# Altium project Stag12.PrjPcb (part 1 of 3)
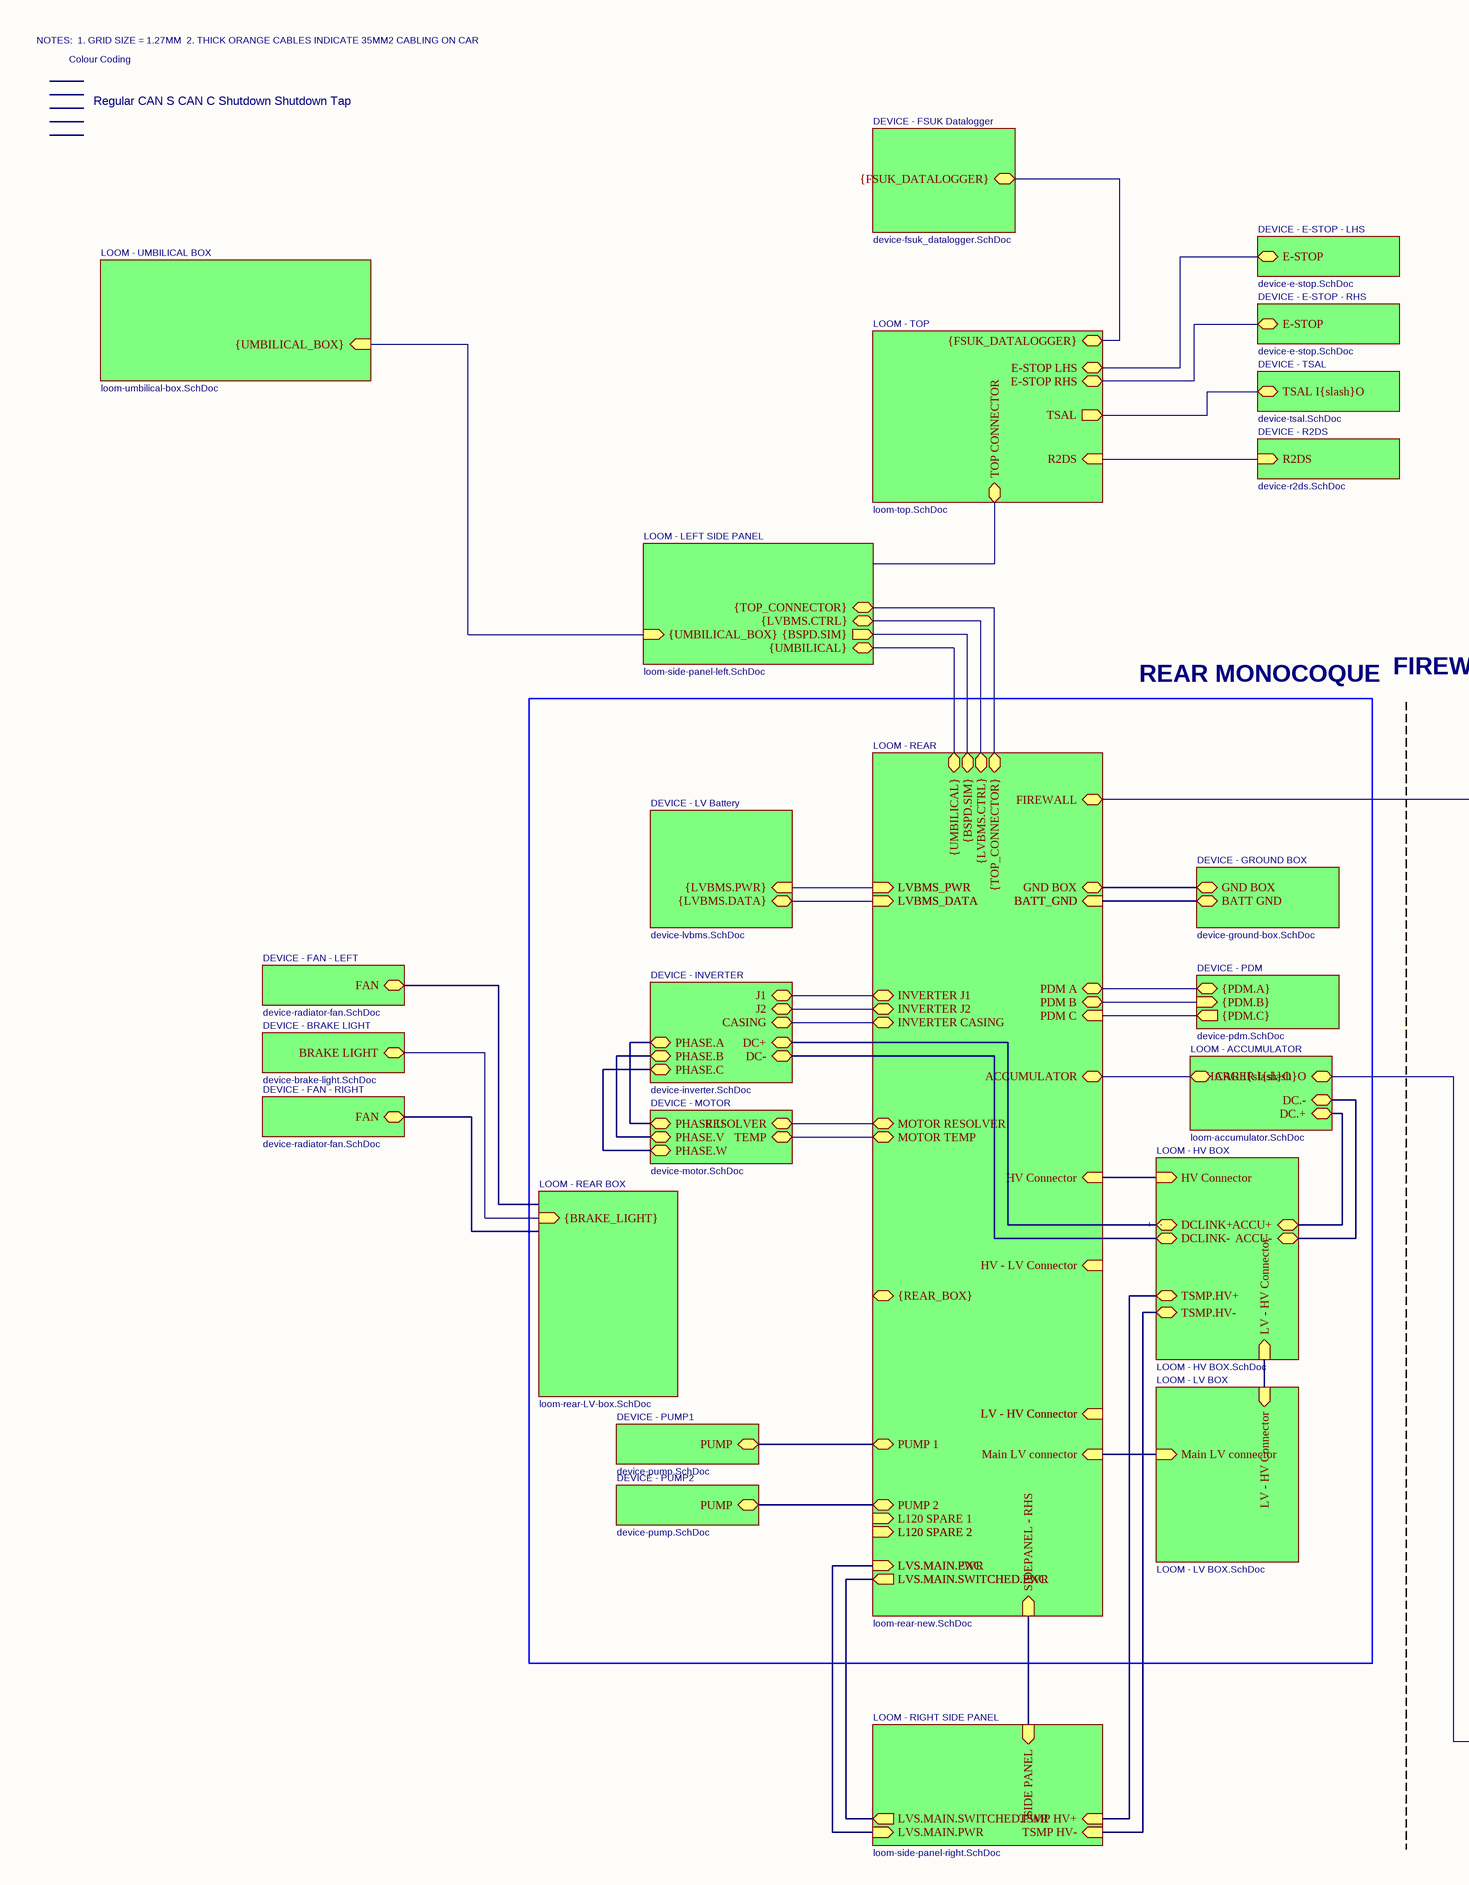
[diagram p0: Stag12.SchDoc, left]
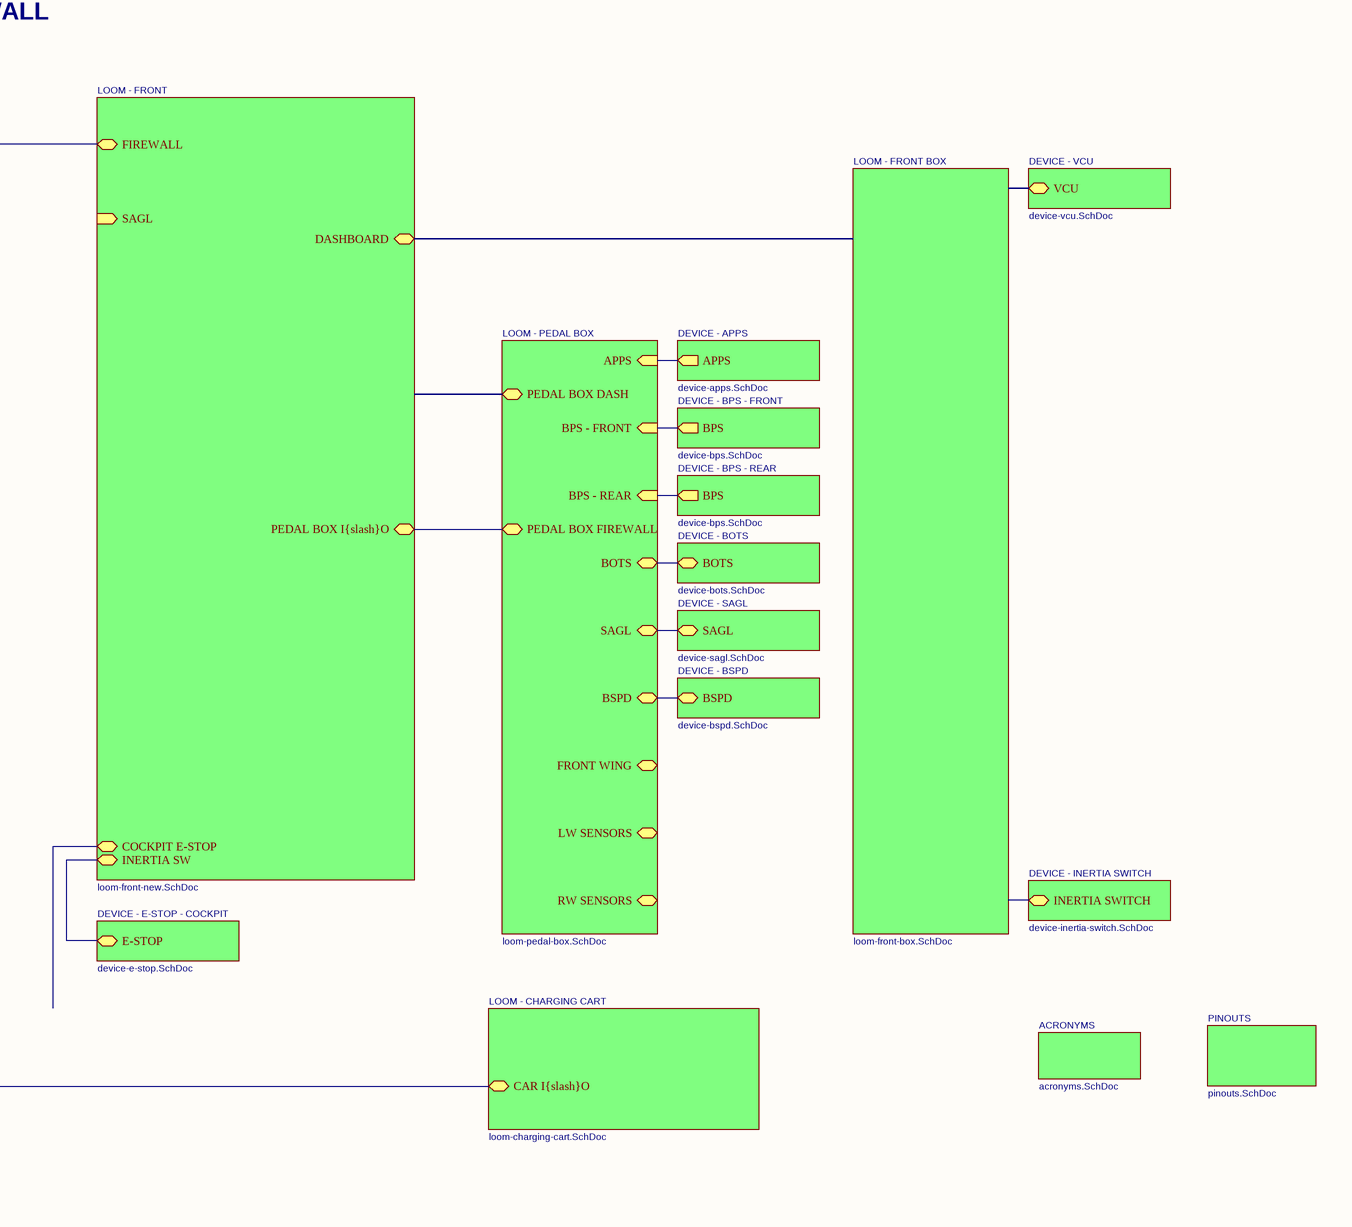
[diagram p1: Stag12.SchDoc, right]
39 sheets, 289 parts. Net scope: hierarchical (ports join the sheet entries above them; power ports are global).
Sheets:
  Stag12.SchDoc
    DEVICE - BOTS = device-bots.SchDoc
    LOOM - REAR BOX = loom-rear-LV-box.SchDoc
    DEVICE - PDM = device-pdm.SchDoc
    ACRONYMS = acronyms.SchDoc
    DEVICE - PUMP2 = device-pump.SchDoc
    LOOM - FRONT = loom-front-new.SchDoc
    DEVICE - E-STOP - COCKPIT = device-e-stop.SchDoc
    DEVICE - INVERTER = device-inverter.SchDoc
    DEVICE - TSAL = device-tsal.SchDoc
    DEVICE - PUMP1 = device-pump.SchDoc
    DEVICE - FAN - RIGHT = device-radiator-fan.SchDoc
    DEVICE - APPS = device-apps.SchDoc
    DEVICE - INERTIA SWITCH = device-inertia-switch.SchDoc
    LOOM - LEFT SIDE PANEL = loom-side-panel-left.SchDoc
    DEVICE - FAN - LEFT = device-radiator-fan.SchDoc
    LOOM - TOP = loom-top.SchDoc
    LOOM - LV BOX = LOOM - LV BOX.SchDoc
    LOOM - HV BOX = LOOM - HV BOX.SchDoc
    DEVICE - E-STOP - LHS = device-e-stop.SchDoc
    DEVICE - BPS - FRONT = device-bps.SchDoc
    LOOM - FRONT BOX = loom-front-box.SchDoc
    DEVICE - E-STOP - RHS = device-e-stop.SchDoc
    LOOM - RIGHT SIDE PANEL = loom-side-panel-right.SchDoc
    DEVICE - BSPD = device-bspd.SchDoc
    DEVICE - GROUND BOX = device-ground-box.SchDoc
    DEVICE - MOTOR = device-motor.SchDoc
    LOOM - REAR = loom-rear-new.SchDoc
    LOOM - CHARGING CART = loom-charging-cart.SchDoc
    DEVICE - SAGL = device-sagl.SchDoc
    DEVICE - VCU = device-vcu.SchDoc
    DEVICE - R2DS = device-r2ds.SchDoc
    LOOM - ACCUMULATOR = loom-accumulator.SchDoc
    PINOUTS = pinouts.SchDoc
    LOOM - UMBILICAL BOX = loom-umbilical-box.SchDoc
    DEVICE - BPS - REAR = device-bps.SchDoc
    DEVICE - LV Battery = device-lvbms.SchDoc
    LOOM - PEDAL BOX = loom-pedal-box.SchDoc
    DEVICE - FSUK Datalogger = device-fsuk_datalogger.SchDoc
    DEVICE - BRAKE LIGHT = device-brake-light.SchDoc
  loom-dash-box.SchDoc
  loom-dummy-accumulator.SchDoc
  loom-roll-hoop.SchDoc
  loom-side-panel.SchDoc

## Sheet Stag12.SchDoc
size 594 x 420 mm

### Sub-sheets
ACRONYMS = acronyms.SchDoc: no entries
DEVICE - APPS = device-apps.SchDoc: APPS (out)
DEVICE - BOTS = device-bots.SchDoc: BOTS (bidir)
DEVICE - BPS - FRONT = device-bps.SchDoc: BPS (out)
DEVICE - BPS - REAR = device-bps.SchDoc: BPS (out)
DEVICE - BRAKE LIGHT = device-brake-light.SchDoc: BRAKE LIGHT (bidir)
DEVICE - BSPD = device-bspd.SchDoc: BSPD (bidir)
DEVICE - E-STOP - COCKPIT = device-e-stop.SchDoc: E-STOP (bidir)
DEVICE - E-STOP - LHS = device-e-stop.SchDoc: E-STOP (bidir)
DEVICE - E-STOP - RHS = device-e-stop.SchDoc: E-STOP (bidir)
DEVICE - FAN - LEFT = device-radiator-fan.SchDoc: FAN (bidir)
DEVICE - FAN - RIGHT = device-radiator-fan.SchDoc: FAN (bidir)
DEVICE - FSUK Datalogger = device-fsuk_datalogger.SchDoc: {FSUK_DATALOGGER} (bidir)
DEVICE - GROUND BOX = device-ground-box.SchDoc: GND BOX (bidir), BATT GND (bidir)
DEVICE - INERTIA SWITCH = device-inertia-switch.SchDoc: INERTIA SWITCH (bidir)
DEVICE - INVERTER = device-inverter.SchDoc: PHASE.A (bidir), PHASE.B (bidir), PHASE.C (bidir), J1 (bidir), J2 (bidir), CASING (bidir), DC+ (bidir), DC- (bidir)
DEVICE - LV Battery = device-lvbms.SchDoc: {LVBMS.PWR} (in), {LVBMS.DATA} (bidir)
DEVICE - MOTOR = device-motor.SchDoc: PHASE.V (bidir), PHASE.U (bidir), PHASE.W (bidir), RESOLVER (bidir), TEMP (bidir)
DEVICE - PDM = device-pdm.SchDoc: {PDM.A} (bidir), {PDM.B} (in), {PDM.C} (out)
DEVICE - PUMP1 = device-pump.SchDoc: PUMP (bidir)
DEVICE - PUMP2 = device-pump.SchDoc: PUMP (bidir)
DEVICE - R2DS = device-r2ds.SchDoc: R2DS (in)
DEVICE - SAGL = device-sagl.SchDoc: SAGL (bidir)
DEVICE - TSAL = device-tsal.SchDoc: TSAL I{slash}O (bidir)
DEVICE - VCU = device-vcu.SchDoc: VCU (bidir)
LOOM - ACCUMULATOR = loom-accumulator.SchDoc: CHARGER I{slash}O (bidir), CAR I{slash}O (bidir), DC.- (bidir), DC.+ (bidir)
LOOM - CHARGING CART = loom-charging-cart.SchDoc: CAR I{slash}O (bidir)
LOOM - FRONT = loom-front-new.SchDoc: DASHBOARD (bidir), FIREWALL (bidir), PEDAL BOX I{slash}O (bidir), SAGL (in), COCKPIT E-STOP (bidir), INERTIA SW (bidir)
LOOM - FRONT BOX = loom-front-box.SchDoc: no entries
LOOM - HV BOX = LOOM - HV BOX.SchDoc: TSMP.HV- (bidir), TSMP.HV+ (bidir), LV - HV Connector (in), HV Connector (in), ACCU+ (bidir), ACCU- (bidir), DCLINK+ (bidir), DCLINK- (bidir)
LOOM - LEFT SIDE PANEL = loom-side-panel-left.SchDoc: {UMBILICAL} (bidir), {LVBMS.CTRL} (bidir), {UMBILICAL_BOX} (in), {BSPD.SIM} (out), {TOP_CONNECTOR} (bidir)
LOOM - LV BOX = LOOM - LV BOX.SchDoc: Main LV connector (in), LV - HV Connector (in)
LOOM - PEDAL BOX = loom-pedal-box.SchDoc: APPS (in), BPS - FRONT (in), BPS - REAR (in), BOTS (bidir), SAGL (bidir), BSPD (bidir), FRONT WING (bidir), LW SENSORS (bidir), PEDAL BOX DASH (bidir), PEDAL BOX FIREWALL (bidir), RW SENSORS (bidir)
LOOM - REAR = loom-rear-new.SchDoc: {UMBILICAL} (bidir), GND BOX (bidir), SIDEPANEL - RHS (in), PDM A (bidir), PDM B (bidir), Main LV connector (in), HV Connector (in), ACCUMULATOR (bidir), FIREWALL (bidir), INVERTER J2 (bidir), INVERTER J1 (bidir), MOTOR RESOLVER (bidir), INVERTER CASING (bidir), MOTOR TEMP (bidir), PUMP 1 (bidir), PUMP 2 (bidir), HV - LV Connector (in), L120 SPARE 1 (in), L120 SPARE 2 (in), LV - HV Connector (in), LVS.MAIN.PWR (in), LVS.MAIN.SWITCHED.PWR (out), BATT_GND (in), LVBMS_DATA (in), LVBMS_PWR (in), L120 SPARE 2 (in), LV - HV Connector (in), LVS.MAIN.EXC (in), LVS.MAIN.SWITCHED.EXC (out), BATT_GND (in), LVBMS_DATA (in), LVBMS_PWR (in), {BSPD.SIM} (bidir), {LVBMS.CTRL} (bidir), PDM C (in), {REAR_BOX} (bidir), {TOP_CONNECTOR} (bidir)
LOOM - REAR BOX = loom-rear-LV-box.SchDoc: {BRAKE_LIGHT} (in)
LOOM - RIGHT SIDE PANEL = loom-side-panel-right.SchDoc: LVS.MAIN.PWR (in), TSMP HV- (in), TSMP HV+ (in), SIDE PANEL (in), LVS.MAIN.SWITCHED.PWR (out)
LOOM - TOP = loom-top.SchDoc: TOP CONNECTOR (bidir), TSAL (out), {FSUK_DATALOGGER} (bidir), E-STOP LHS (bidir), E-STOP RHS (bidir), R2DS (in)
LOOM - UMBILICAL BOX = loom-umbilical-box.SchDoc: {UMBILICAL_BOX} (in)
PINOUTS = pinouts.SchDoc: no entries

### Nets
BATT.POS: sheet DEVICE - PDM/{PDM.B}, sheet LOOM - REAR/PDM B
CASING: sheet DEVICE - INVERTER/CASING, sheet LOOM - REAR/INVERTER CASING
DC+: sheet DEVICE - INVERTER/DC+, sheet LOOM - HV BOX/DCLINK+
DC-: sheet DEVICE - INVERTER/DC-, sheet LOOM - HV BOX/DCLINK-
GLV.GND: sheet DEVICE - GROUND BOX/BATT GND, sheet LOOM - REAR/BATT_GND, sheet LOOM - REAR/BATT_GND
GLV.LVMS+: sheet LOOM - RIGHT SIDE PANEL/LVS.MAIN.PWR, sheet LOOM - REAR/LVS.MAIN.PWR, sheet LOOM - REAR/LVS.MAIN.EXC
GND BOX: sheet DEVICE - GROUND BOX/GND BOX, sheet LOOM - REAR/GND BOX
HV Connector: sheet LOOM - HV BOX/HV Connector, sheet LOOM - REAR/HV Connector
L120 SPARE 2: sheet LOOM - REAR/L120 SPARE 2, sheet LOOM - REAR/L120 SPARE 2
LV - HV Connector: sheet LOOM - LV BOX/LV - HV Connector, sheet LOOM - HV BOX/LV - HV Connector
LVS.MAIN.SWITCHED.EXC: sheet LOOM - RIGHT SIDE PANEL/LVS.MAIN.SWITCHED.PWR, sheet LOOM - REAR/LVS.MAIN.SWITCHED.PWR, sheet LOOM - REAR/LVS.MAIN.SWITCHED.EXC
Main LV connector: sheet LOOM - LV BOX/Main LV connector, sheet LOOM - REAR/Main LV connector
PHASE.A: sheet DEVICE - INVERTER/PHASE.A, sheet DEVICE - MOTOR/PHASE.U
PHASE.B: sheet DEVICE - INVERTER/PHASE.B, sheet DEVICE - MOTOR/PHASE.V
PHASE.C: sheet DEVICE - INVERTER/PHASE.C, sheet DEVICE - MOTOR/PHASE.W
PUMP_DEVICE - PUMP1: sheet DEVICE - PUMP1/PUMP, sheet LOOM - REAR/PUMP 1
PUMP_DEVICE - PUMP2: sheet DEVICE - PUMP2/PUMP, sheet LOOM - REAR/PUMP 2
SIDE PANEL: sheet LOOM - RIGHT SIDE PANEL/SIDE PANEL, sheet LOOM - REAR/SIDEPANEL - RHS
TSMP HV+: sheet LOOM - HV BOX/TSMP.HV+, sheet LOOM - RIGHT SIDE PANEL/TSMP HV+
TSMP HV-: sheet LOOM - HV BOX/TSMP.HV-, sheet LOOM - RIGHT SIDE PANEL/TSMP HV-
(unnamed): sheet LOOM - HV BOX/ACCU+, sheet LOOM - ACCUMULATOR/DC.+
(unnamed): sheet LOOM - HV BOX/ACCU-, sheet LOOM - ACCUMULATOR/DC.-
(unnamed): sheet LOOM - REAR/LV - HV Connector, sheet LOOM - REAR/LV - HV Connector

### Buses and harness runs
bus sheet DEVICE - APPS/APPS = sheet LOOM - PEDAL BOX/APPS
bus sheet DEVICE - BOTS/BOTS = sheet LOOM - PEDAL BOX/BOTS
bus sheet DEVICE - BPS - FRONT/BPS = sheet LOOM - PEDAL BOX/BPS - FRONT
bus sheet DEVICE - BPS - REAR/BPS = sheet LOOM - PEDAL BOX/BPS - REAR
bus sheet DEVICE - BRAKE LIGHT/BRAKE LIGHT = sheet LOOM - REAR BOX/{BRAKE_LIGHT}
bus sheet DEVICE - BSPD/BSPD = sheet LOOM - PEDAL BOX/BSPD
bus sheet DEVICE - E-STOP - COCKPIT/E-STOP = sheet LOOM - FRONT/INERTIA SW
bus sheet DEVICE - E-STOP - LHS/E-STOP = sheet LOOM - TOP/E-STOP LHS
bus sheet DEVICE - E-STOP - RHS/E-STOP = sheet LOOM - TOP/E-STOP RHS
bus sheet DEVICE - FSUK Datalogger/{FSUK_DATALOGGER} = sheet LOOM - TOP/{FSUK_DATALOGGER}
bus sheet DEVICE - INVERTER/CASING = sheet LOOM - REAR/INVERTER CASING
bus sheet DEVICE - INVERTER/J1 = sheet LOOM - REAR/INVERTER J1
bus sheet DEVICE - INVERTER/J2 = sheet LOOM - REAR/INVERTER J2
bus sheet DEVICE - LV Battery/{LVBMS.DATA} = sheet LOOM - REAR/LVBMS_DATA
bus sheet DEVICE - LV Battery/{LVBMS.PWR} = sheet LOOM - REAR/LVBMS_PWR
bus sheet DEVICE - MOTOR/RESOLVER = sheet LOOM - REAR/MOTOR RESOLVER
bus sheet DEVICE - MOTOR/TEMP = sheet LOOM - REAR/MOTOR TEMP
bus sheet DEVICE - PDM/{PDM.A} = sheet LOOM - REAR/PDM A
bus sheet DEVICE - PDM/{PDM.B} = sheet LOOM - REAR/PDM B
bus sheet DEVICE - PDM/{PDM.C} = sheet LOOM - REAR/PDM C
bus sheet DEVICE - R2DS/R2DS = sheet LOOM - TOP/R2DS
bus sheet DEVICE - SAGL/SAGL = sheet LOOM - PEDAL BOX/SAGL
bus sheet DEVICE - TSAL/TSAL I{slash}O = sheet LOOM - TOP/TSAL
bus sheet LOOM - ACCUMULATOR/CAR I{slash}O = sheet LOOM - REAR/ACCUMULATOR
bus sheet LOOM - ACCUMULATOR/CHARGER I{slash}O = sheet LOOM - CHARGING CART/CAR I{slash}O
bus sheet LOOM - FRONT/FIREWALL = sheet LOOM - REAR/FIREWALL
bus sheet LOOM - FRONT/PEDAL BOX I{slash}O = sheet LOOM - PEDAL BOX/PEDAL BOX FIREWALL
bus sheet LOOM - LEFT SIDE PANEL/{BSPD.SIM} = sheet LOOM - REAR/{BSPD.SIM}
bus sheet LOOM - LEFT SIDE PANEL/{LVBMS.CTRL} = sheet LOOM - REAR/{LVBMS.CTRL}
bus sheet LOOM - LEFT SIDE PANEL/{TOP_CONNECTOR} = sheet LOOM - REAR/{TOP_CONNECTOR}
bus sheet LOOM - LEFT SIDE PANEL/{UMBILICAL_BOX} = sheet LOOM - UMBILICAL BOX/{UMBILICAL_BOX}
bus sheet LOOM - LEFT SIDE PANEL/{UMBILICAL} = sheet LOOM - REAR/{UMBILICAL}

### Notes on the sheet
- NOTES:
  1. GRID SIZE = 1.27MM
  2. THICK ORANGE CABLES INDICATE 35MM2 CABLING ON CAR
- Colour Coding
- Regular
  CAN S
  CAN C
  Shutdown
  Shutdown Tap
- REAR MONOCOQUE
- FIREWALL
- +
  -
- 1
- 2
- 3
- 4
- 5
- 6
- 7
- 8
- 9
- 10
- 11
- A
- B
- C
- D
- E
- F
- G
- H
- Title: STAG 12 - TOP LEVEL
- File: Stag12.kicad_sch
- Sheet: /
- KiCad E.D.A.  kicad (5.1.4)-1
- Size: A2
- Date:
- Rev:
- Id: 1/1

## Sheet device-bots.SchDoc
size 297 x 209 mm
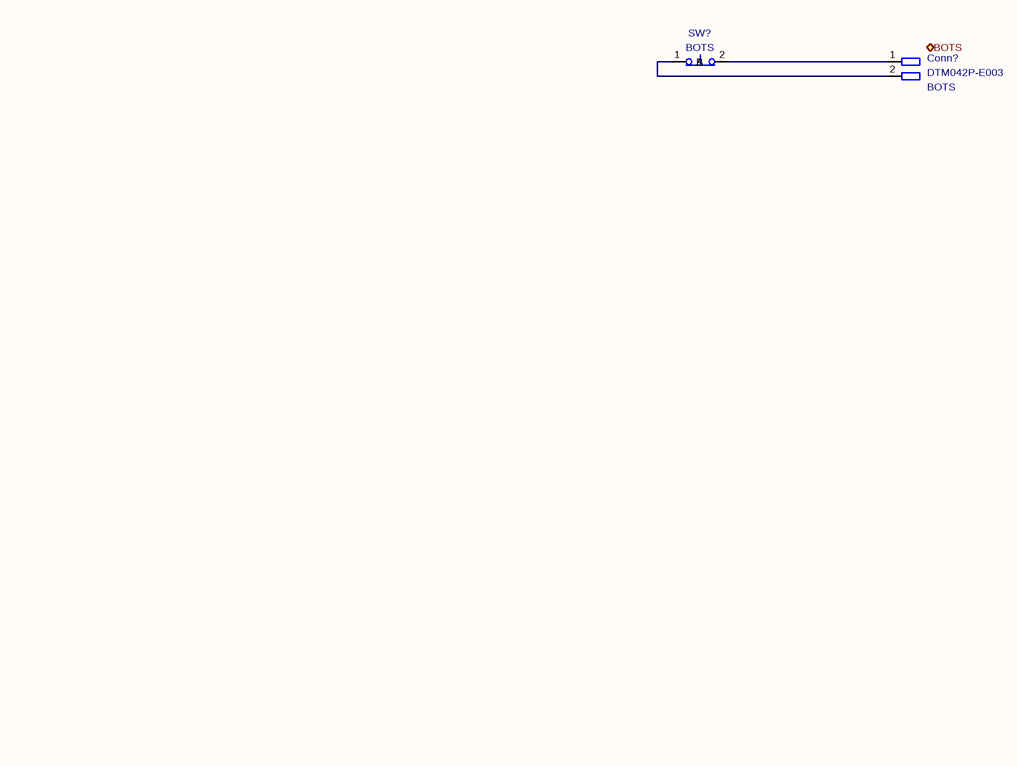
[diagram p2: device-bots.SchDoc]

### Parts
(Parts that share a designator on the sheet are numbered #1, #2 ... from top to bottom, then left to right.)
Conn?#1  P/N: DTM042P-E003  Conn Name: BOTS  (hidden comment: Deutsch_DTM_2P_Pin)
SW?  BOTS

### Ports
BOTS (bidir)

### Nets
NetConn?#1_1: Conn?#1.1 SW?.2(B)
NetConn?#1_2: Conn?#1.2 SW?.1(A)

### Notes on the sheet
- 1
- 2
- 3
- 4
- 5
- 6
- A
- B
- C
- D
- Title: DEVICE - BOTS
- File: device-bots.kicad_sch
- Sheet: /
- KiCad E.D.A.  kicad (5.1.4)-1
- Size: A4
- Date:
- Rev:
- Id: 1/1

### Library data of the parts
SW? = SW_Push_Open: Value: BOTS
Conn?#1 = Deutsch_DTM_2P_Pin: Value: Deutsch_DTM_2P_Pin

## Sheet loom-rear-LV-box.SchDoc
size 420 x 297 mm
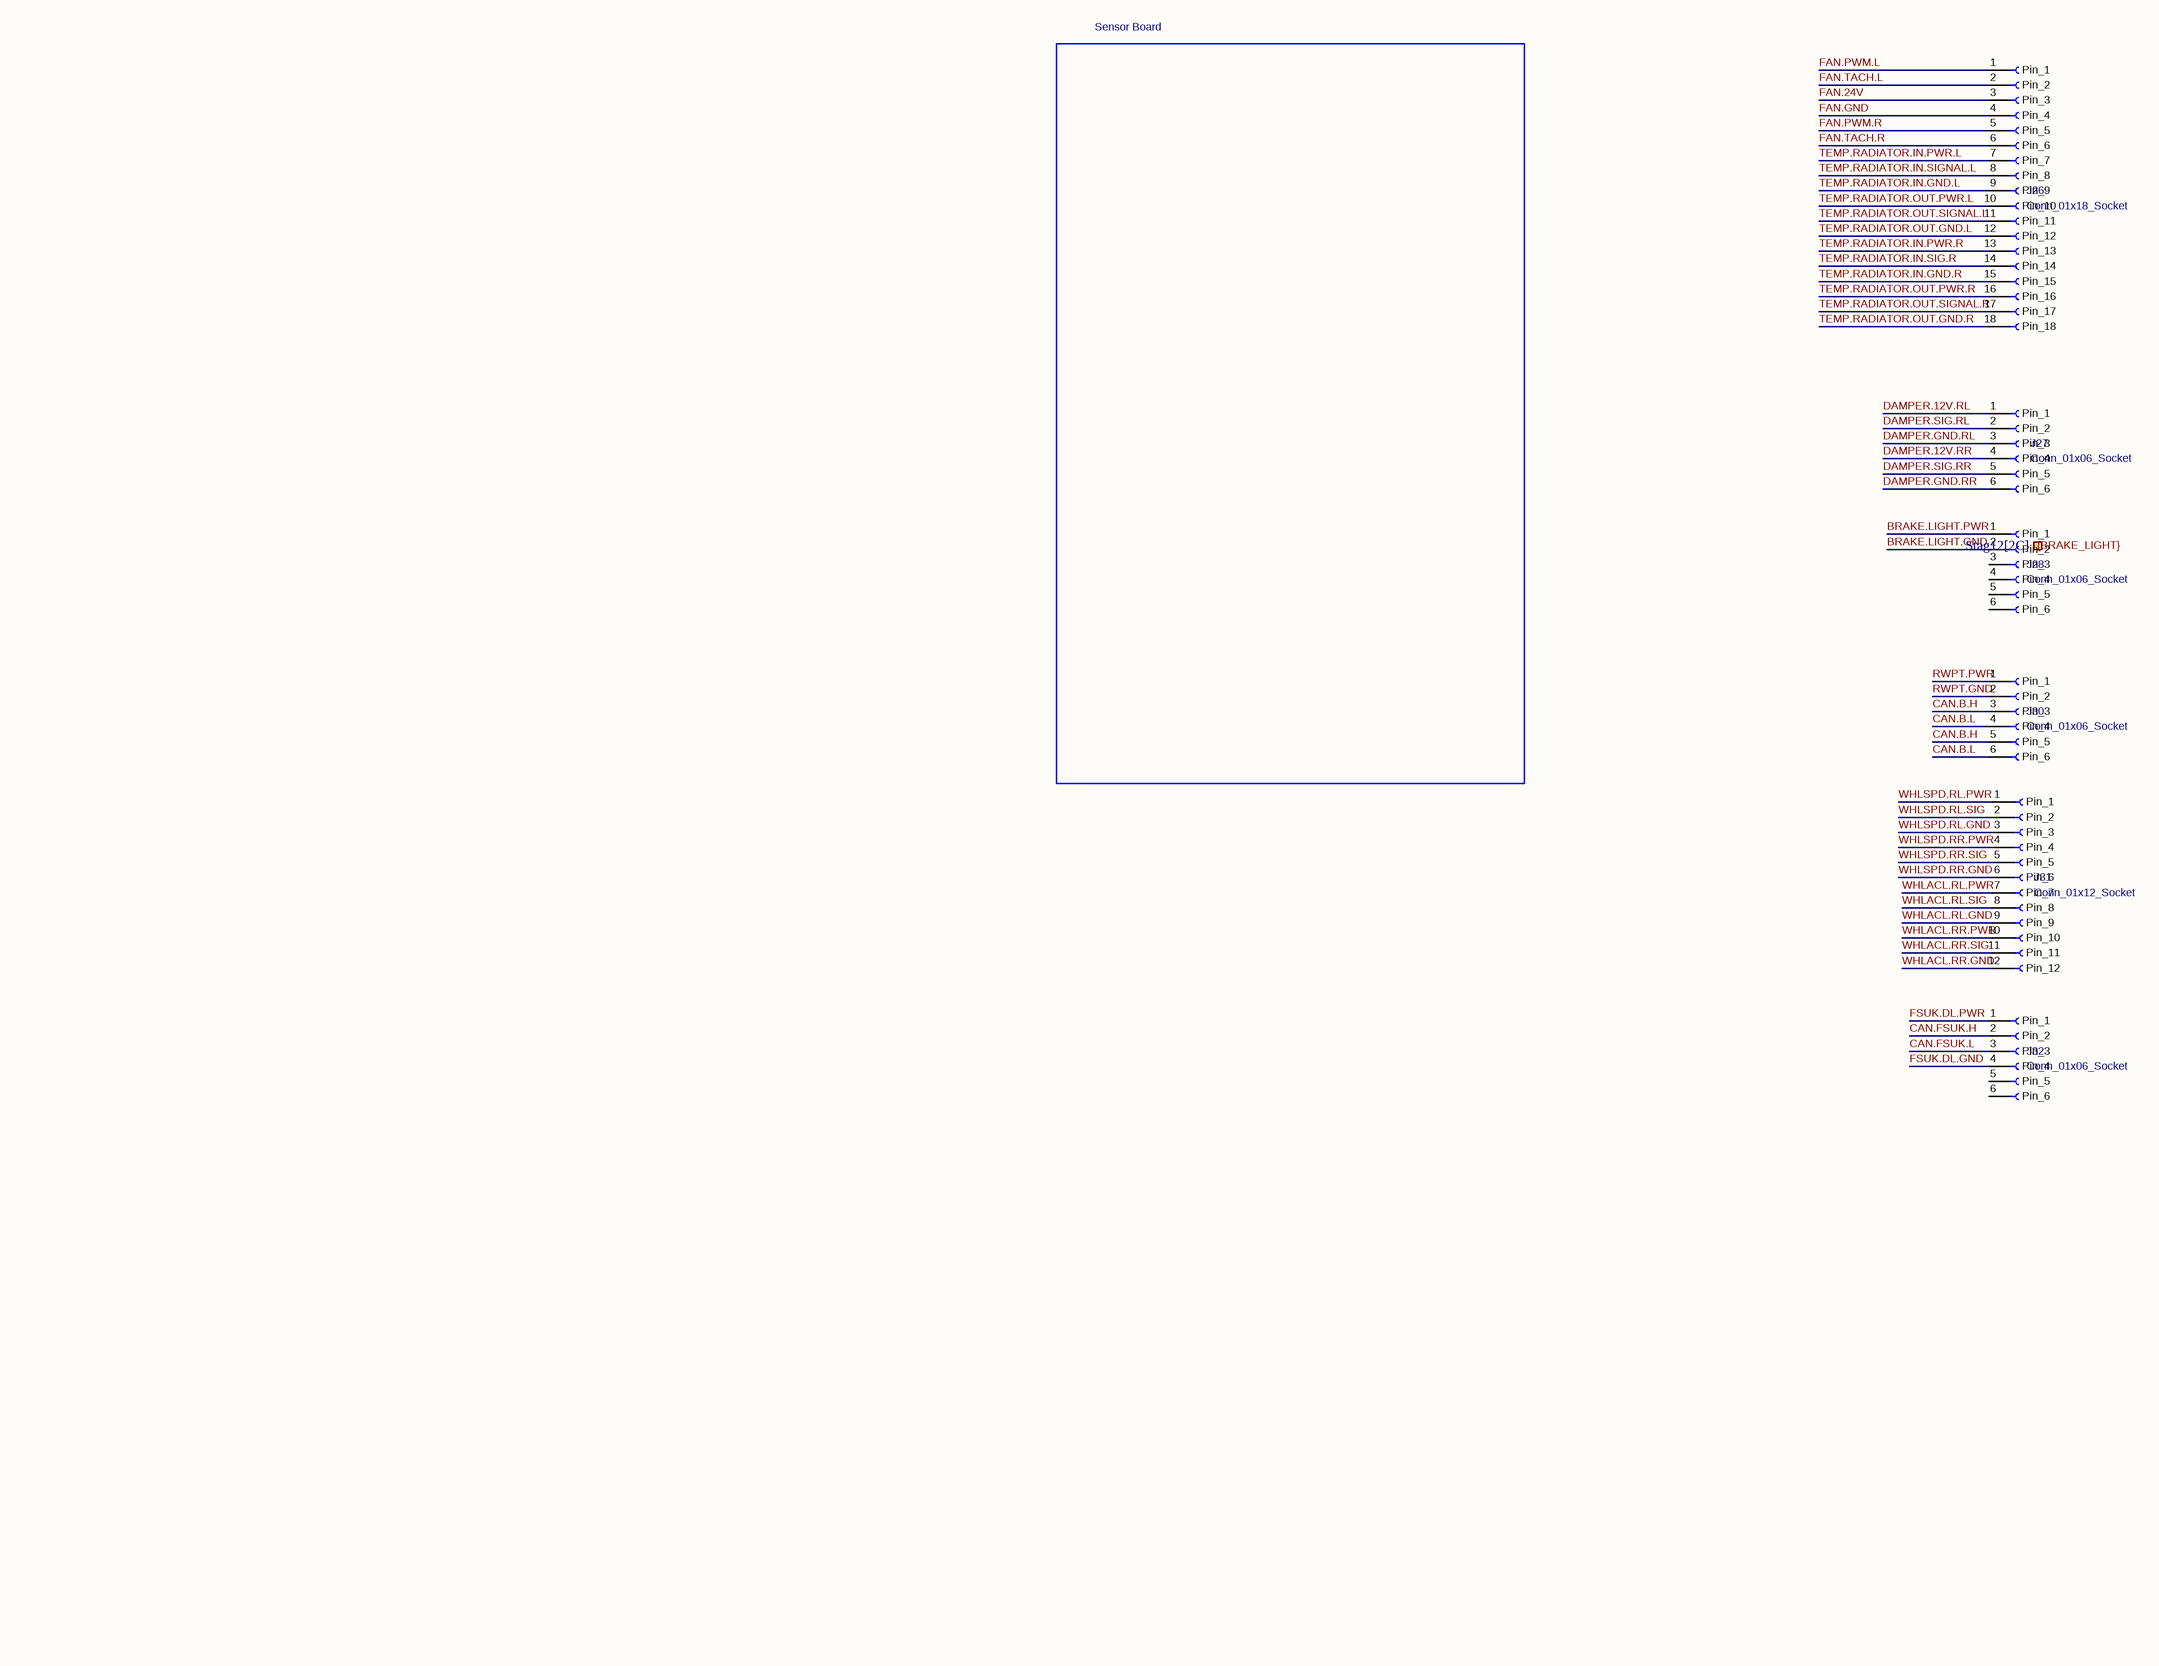
[diagram p3: loom-rear-LV-box.SchDoc]

### Parts
J26  Conn_01x18_Socket
J27  Conn_01x06_Socket
J28  Conn_01x06_Socket
J30  Conn_01x06_Socket
J31  Conn_01x12_Socket
J32  Conn_01x06_Socket

### Ports
{BRAKE_LIGHT} (in, see Stag12[2C])

### Nets
BRAKE.LIGHT.GND: J28.2(Pin_2)
BRAKE.LIGHT.PWR: J28.1(Pin_1)
CAN.B.H: J30.3(Pin_3) J30.5(Pin_5)
CAN.B.L: J30.4(Pin_4) J30.6(Pin_6)
CAN.FSUK.H: J32.2(Pin_2)
CAN.FSUK.L: J32.3(Pin_3)
DAMPER.12V.RL: J27.1(Pin_1)
DAMPER.12V.RR: J27.4(Pin_4)
DAMPER.GND.RL: J27.3(Pin_3)
DAMPER.GND.RR: J27.6(Pin_6)
DAMPER.SIG.RL: J27.2(Pin_2)
DAMPER.SIG.RR: J27.5(Pin_5)
FAN.24V: J26.3(Pin_3)
FAN.GND: J26.4(Pin_4)
FAN.PWM.L: J26.1(Pin_1)
FAN.PWM.R: J26.5(Pin_5)
FAN.TACH.L: J26.2(Pin_2)
FAN.TACH.R: J26.6(Pin_6)
FSUK.DL.GND: J32.4(Pin_4)
FSUK.DL.PWR: J32.1(Pin_1)
RWPT.GND: J30.2(Pin_2)
RWPT.PWR: J30.1(Pin_1)
TEMP.RADIATOR.IN.GND.L: J26.9(Pin_9)
TEMP.RADIATOR.IN.GND.R: J26.15(Pin_15)
TEMP.RADIATOR.IN.PWR.L: J26.7(Pin_7)
TEMP.RADIATOR.IN.PWR.R: J26.13(Pin_13)
TEMP.RADIATOR.IN.SIG.R: J26.14(Pin_14)
TEMP.RADIATOR.IN.SIGNAL.L: J26.8(Pin_8)
TEMP.RADIATOR.OUT.GND.L: J26.12(Pin_12)
TEMP.RADIATOR.OUT.GND.R: J26.18(Pin_18)
TEMP.RADIATOR.OUT.PWR.L: J26.10(Pin_10)
TEMP.RADIATOR.OUT.PWR.R: J26.16(Pin_16)
TEMP.RADIATOR.OUT.SIGNAL.L: J26.11(Pin_11)
TEMP.RADIATOR.OUT.SIGNAL.R: J26.17(Pin_17)
WHLACL.RL.GND: J31.9(Pin_9)
WHLACL.RL.PWR: J31.7(Pin_7)
WHLACL.RL.SIG: J31.8(Pin_8)
WHLACL.RR.GND: J31.12(Pin_12)
WHLACL.RR.PWR: J31.10(Pin_10)
WHLACL.RR.SIG: J31.11(Pin_11)
WHLSPD.RL.GND: J31.3(Pin_3)
WHLSPD.RL.PWR: J31.1(Pin_1)
WHLSPD.RL.SIG: J31.2(Pin_2)
WHLSPD.RR.GND: J31.6(Pin_6)
WHLSPD.RR.PWR: J31.4(Pin_4)
WHLSPD.RR.SIG: J31.5(Pin_5)

Not connected (* = marked no-connect by the designer): J28 3(Pin_3) 4(Pin_4) 5(Pin_5) 6(Pin_6); J32 5(Pin_5) 6(Pin_6)

### Notes on the sheet
- Sensor Board
- 1
- 2
- 3
- 4
- 5
- 6
- 7
- 8
- A
- B
- C
- D
- E
- Title:
- File: loom-rear-LV-box.kicad_sch
- Sheet: /
- F
- KiCad E.D.A.  kicad (5.1.4)-1
- Size: A3
- Date:
- Rev:
- Id: 1/1

### Library data of the parts
J26 = Conn_01x18_Socket: Value: Conn_01x18_Socket
J27 J28 J30 J32 = Conn_01x06_Socket: Value: Conn_01x06_Socket
J31 = Conn_01x12_Socket: Value: Conn_01x12_Socket

## Sheet device-pdm.SchDoc
size 297 x 209 mm
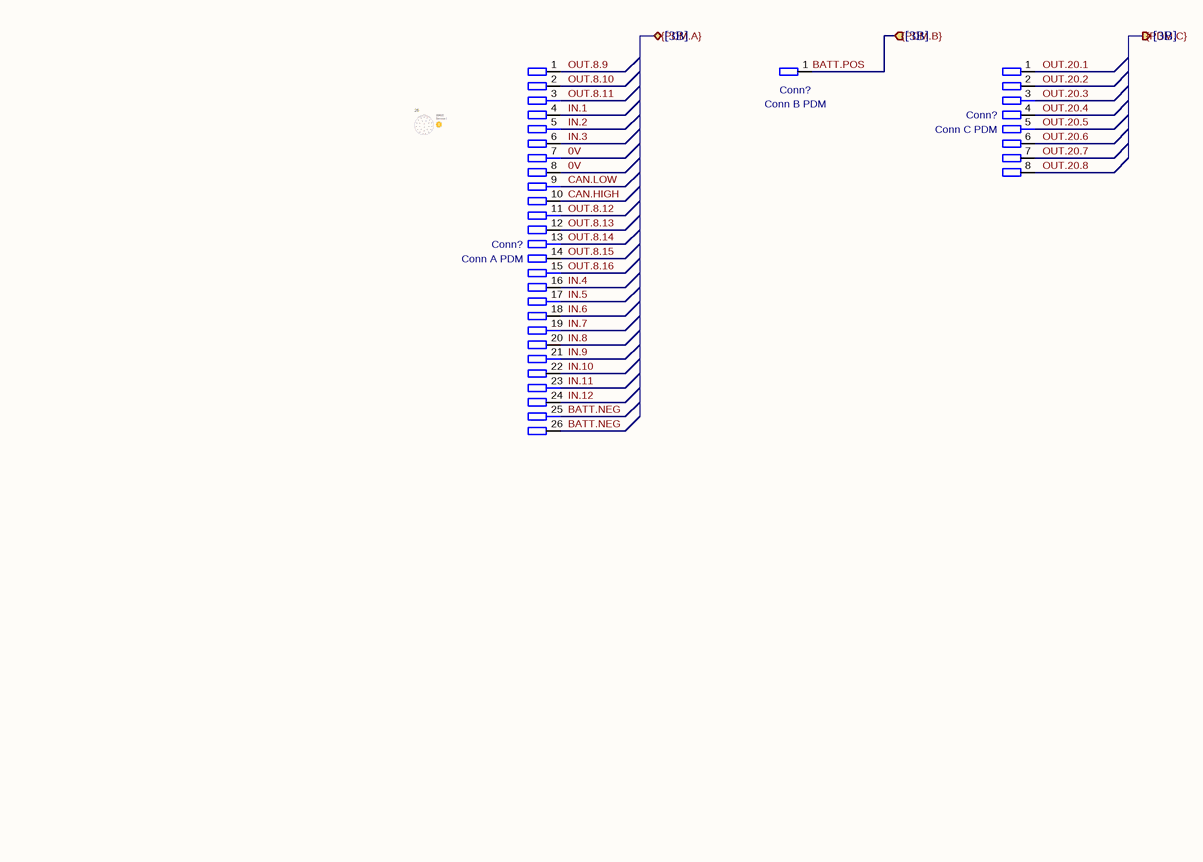
[diagram p4: device-pdm.SchDoc]

### Parts
(Parts that share a designator on the sheet are numbered #1, #2 ... from top to bottom, then left to right.)
Conn?#2  Conn A PDM
Conn?#3  Conn B PDM
Conn?#4  Conn C PDM

### Ports
{PDM.A} (bidir, see [3B]), {PDM.B} (in, see [3B]), {PDM.C} (out, see [3B])

### Nets
0V: Conn?#2.7 Conn?#2.8
BATT.NEG: Conn?#2.25 Conn?#2.26
BATT.POS: Conn?#3.1 ; port {PDM.B}
CAN.HIGH: Conn?#2.10
CAN.LOW: Conn?#2.9
IN.1: Conn?#2.4
IN.2: Conn?#2.5
IN.3: Conn?#2.6
IN.4: Conn?#2.16
IN.5: Conn?#2.17
IN.6: Conn?#2.18
IN.7: Conn?#2.19
IN.8: Conn?#2.20
IN.9: Conn?#2.21
IN.10: Conn?#2.22
IN.11: Conn?#2.23
IN.12: Conn?#2.24
OUT.8.9: Conn?#2.1
OUT.8.10: Conn?#2.2
OUT.8.11: Conn?#2.3
OUT.8.12: Conn?#2.11
OUT.8.13: Conn?#2.12
OUT.8.14: Conn?#2.13
OUT.8.15: Conn?#2.14
OUT.8.16: Conn?#2.15
OUT.20.1: Conn?#4.1
OUT.20.2: Conn?#4.2
OUT.20.3: Conn?#4.3
OUT.20.4: Conn?#4.4
OUT.20.5: Conn?#4.5
OUT.20.6: Conn?#4.6
OUT.20.7: Conn?#4.7
OUT.20.8: Conn?#4.8

### Notes on the sheet
- 1
- 2
- 3
- 4
- 5
- 6
- A
- B
- C
- D
- Title: DEVICE - PDM
- File: device-pdm.kicad_sch
- Sheet: /
- KiCad E.D.A.  kicad (5.1.4)-1
- Size: A4
- Date:
- Rev:
- Id: 1/1

### Library data of the parts
Conn?#2 = Conn A PDM: Value: Conn A PDM
Conn?#3 = Conn B PDM: Value: Conn B PDM
Conn?#4 = Conn C PDM: Value: Conn C PDM

## Sheet acronyms.SchDoc
size 420 x 297 mm
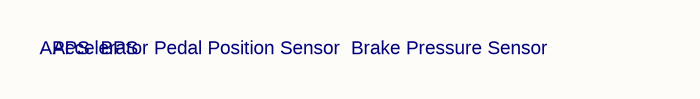
[diagram p5: acronyms.SchDoc]

### Notes on the sheet
- APPS
  BPS
- Accelerator Pedal Position Sensor
  Brake Pressure Sensor
- 1
- 2
- 3
- 4
- 5
- 6
- 7
- 8
- A
- B
- C
- D
- E
- Title: MISC - ACRONYMS
- File: acronyms.kicad_sch
- Sheet: /
- F
- KiCad E.D.A.  kicad (5.1.4)-1
- Size: A3
- Date:
- Rev:
- Id: 1/1

## Sheet device-pump.SchDoc
size 297 x 209 mm
Used 2 times, as channels DEVICE - PUMP2, DEVICE - PUMP1. Parts and nets are listed once, with the designators drawn on the sheet.
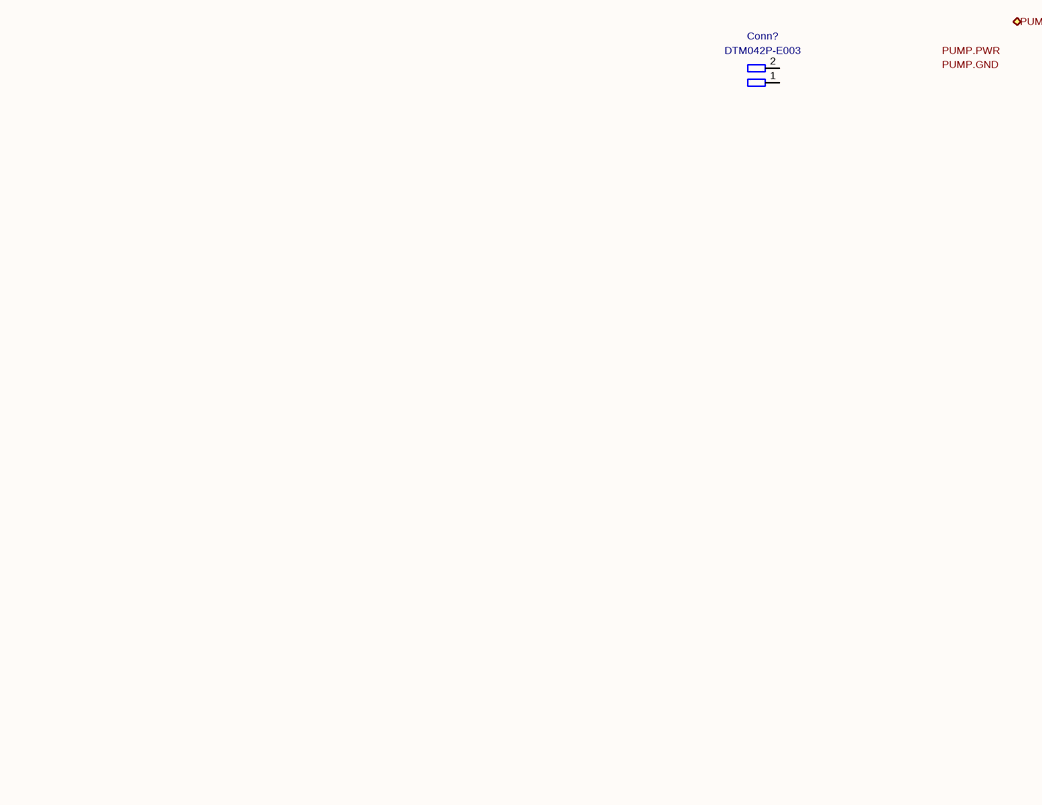
[diagram p6: device-pump.SchDoc]

### Parts
Conn?  P/N: DTM042P-E003  (hidden comment: Deutsch_DTM_2P_Pin)

### Ports
PUMP (bidir)

### Nets

Not connected (* = marked no-connect by the designer): Conn? 1 2

### Channels
DEVICE - PUMP2: designators end in _DEVICE_-_PUMP2; ports PUMP=PUMP_DEVICE - PUMP2
DEVICE - PUMP1: designators end in _DEVICE_-_PUMP1; ports PUMP=PUMP_DEVICE - PUMP1

### Notes on the sheet
- Labels drawn without touching a wire or pin: PUMP.GND, PUMP.PWR
- 1
- 2
- 3
- 4
- 5
- 6
- A
- B
- C
- D
- Title: DEVICE - PUMP
- File: device-pump.kicad_sch
- Sheet: /
- KiCad E.D.A.  kicad (5.1.4)-1
- Size: A4
- Date:
- Rev:
- Id: 1/1

### Library data of the parts
Conn? = Deutsch_DTM_2P_Pin: Value: Deutsch_DTM_2P_Pin

## Sheet loom-front-new.SchDoc
size 594 x 420 mm
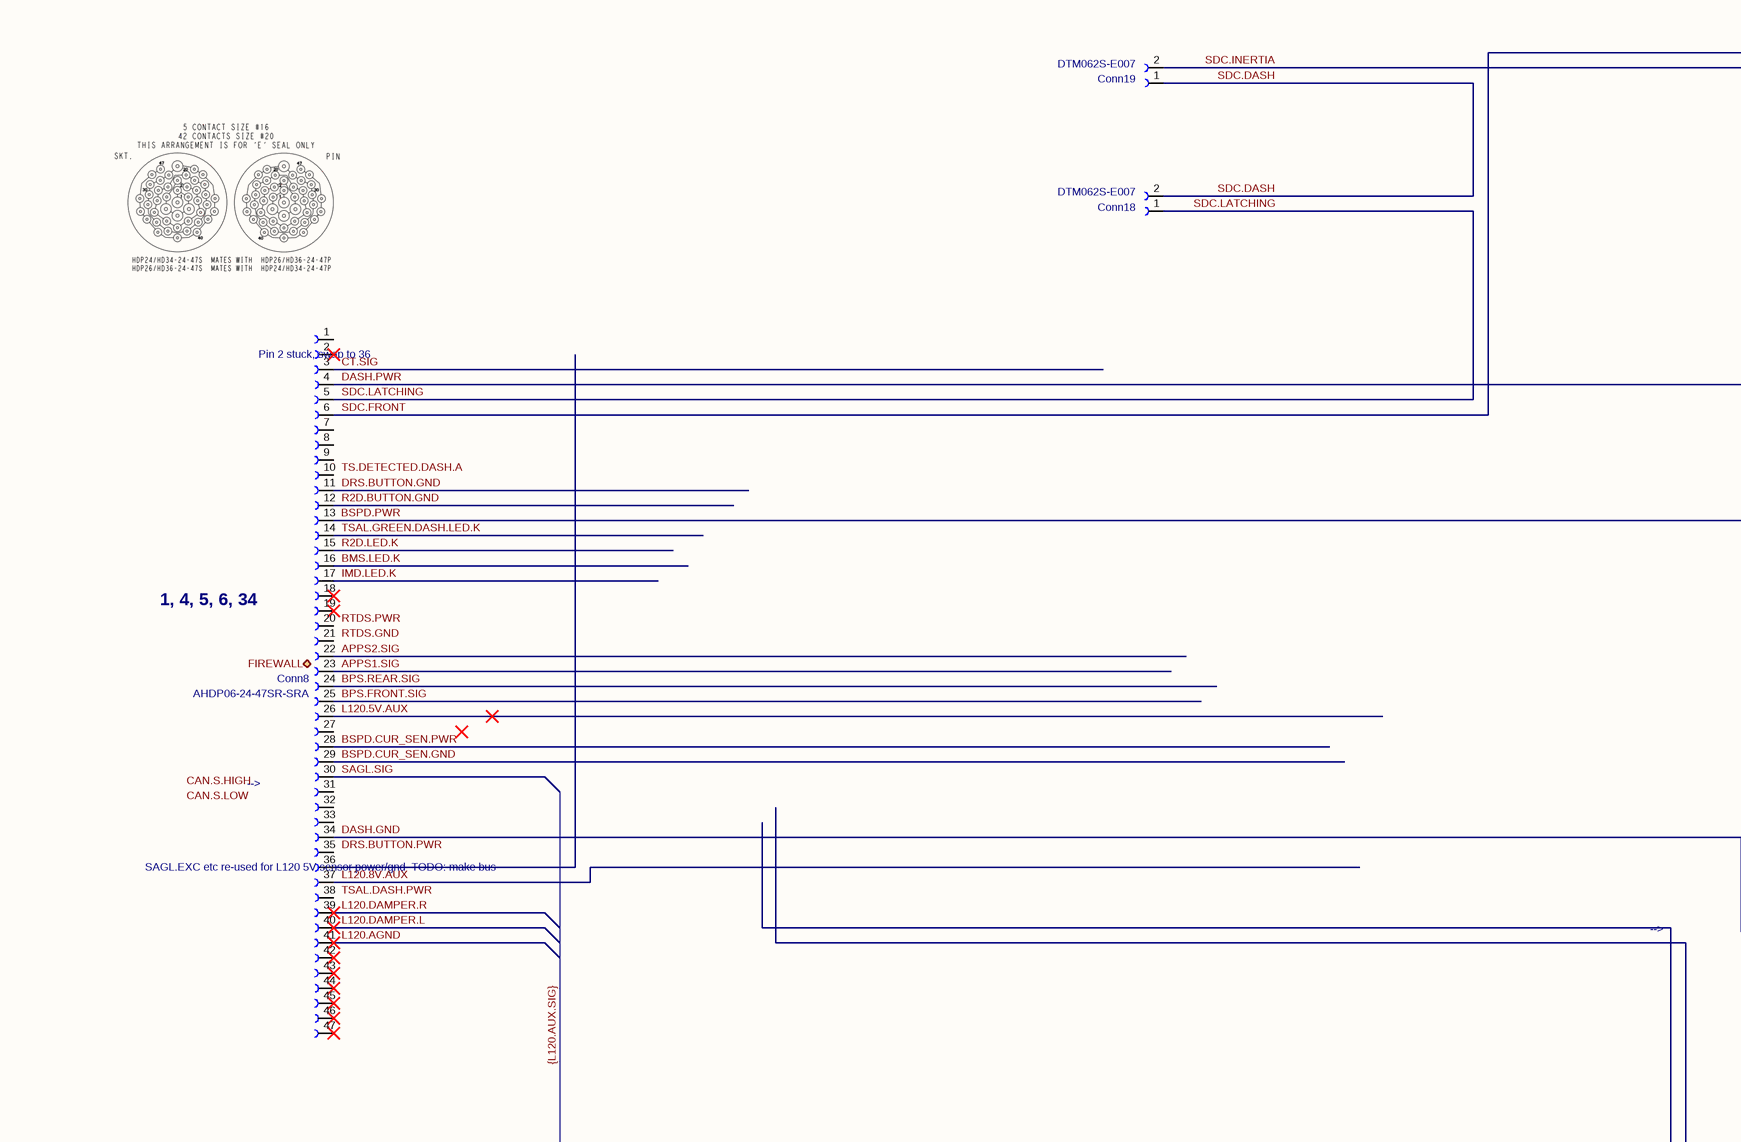
[diagram p7: loom-front-new.SchDoc, top left]
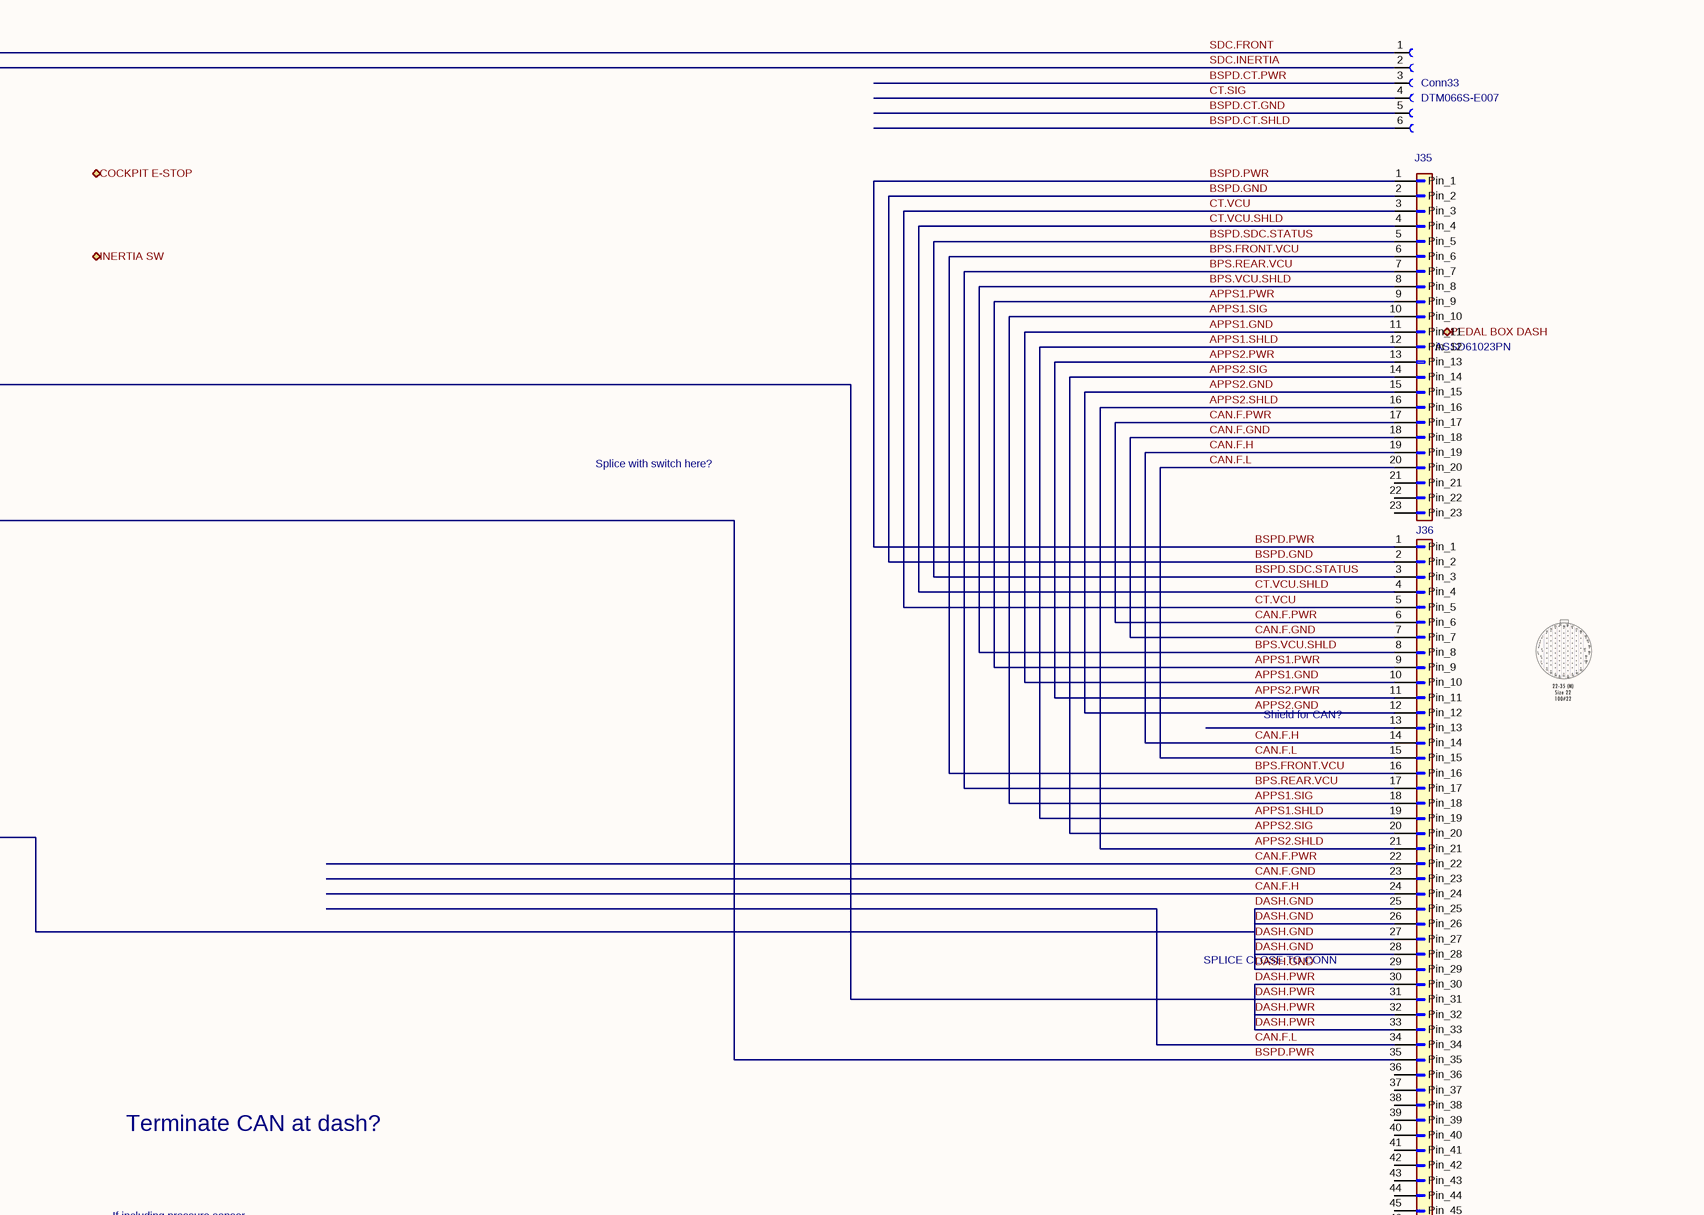
[diagram p8: loom-front-new.SchDoc, top right]
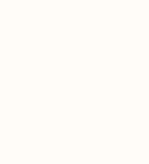
[diagram p9: loom-front-new.SchDoc, bottom left]
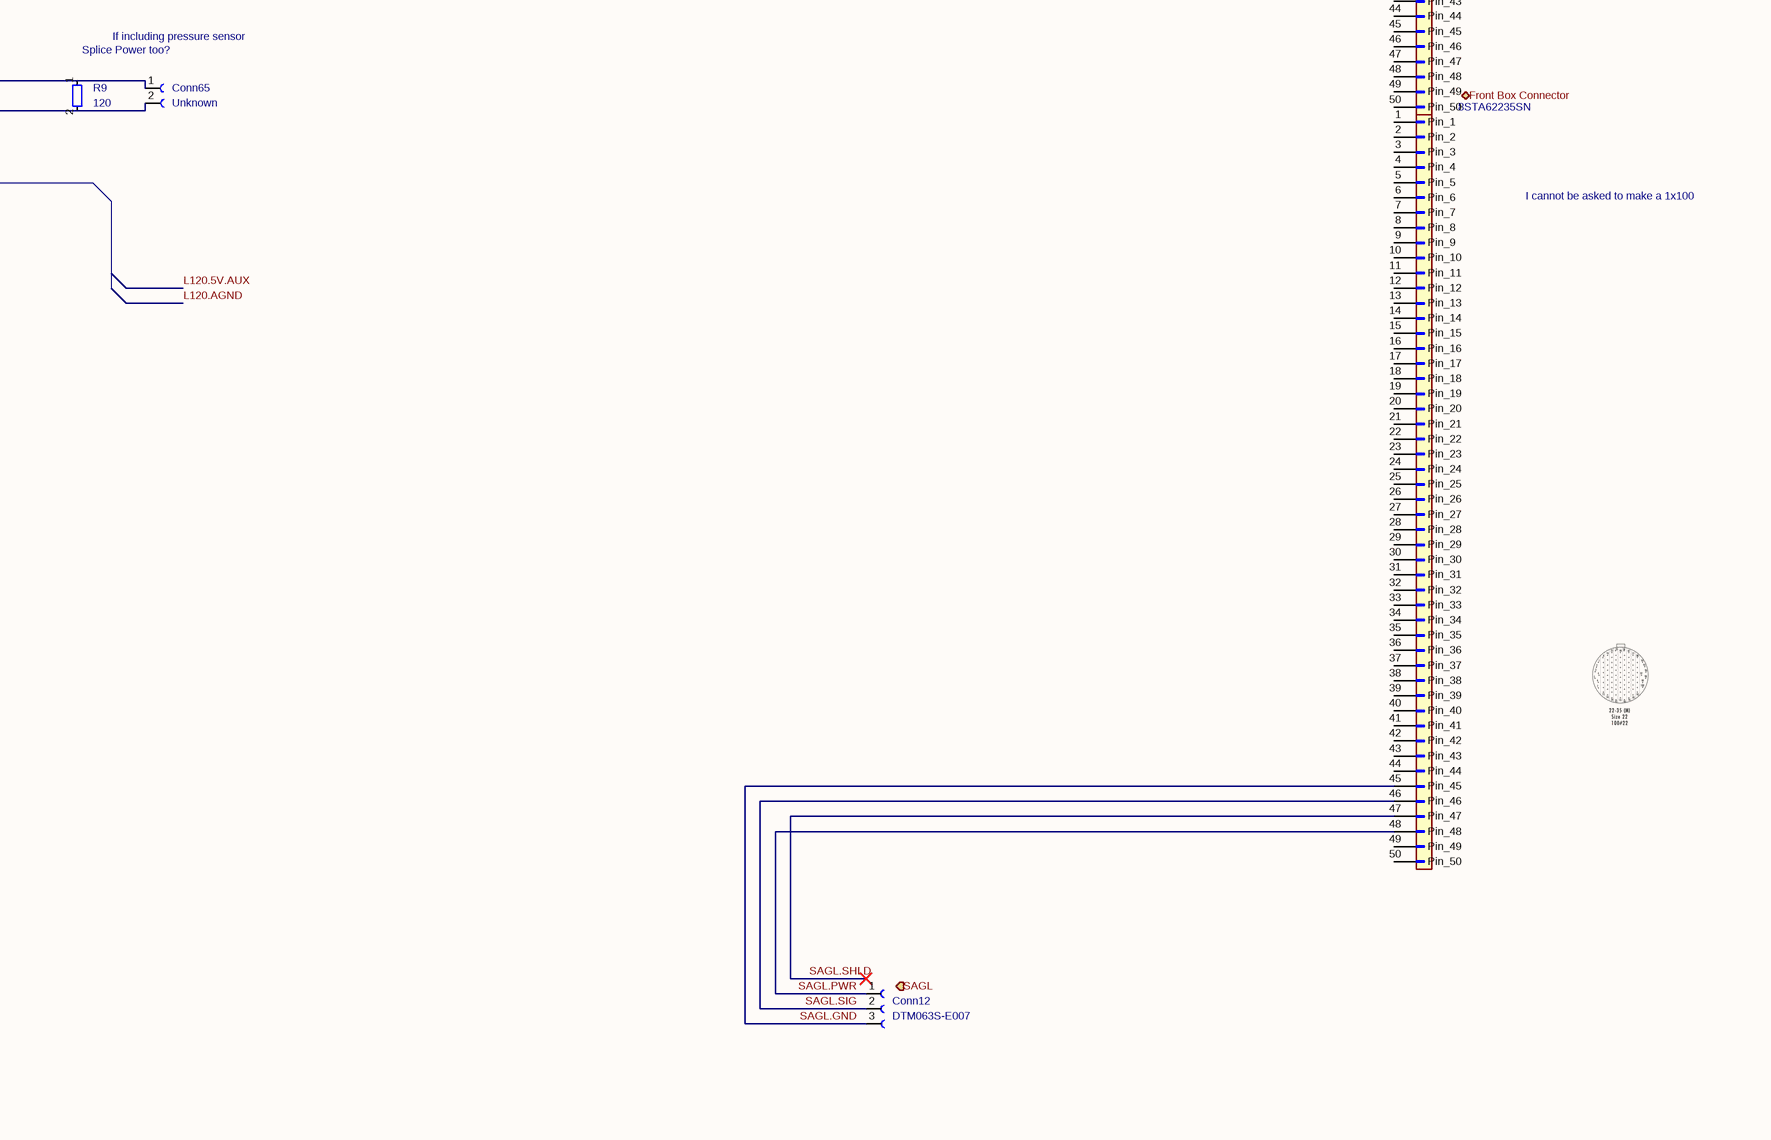
[diagram p10: loom-front-new.SchDoc, bottom right]

### Parts
(Parts that share a designator on the sheet are numbered #1, #2 ... from top to bottom, then left to right.)
Conn8#1  P/N: AHDP06-24-47SR-SRA  (hidden comment: AMPHENOL-47P-Recepticle)
Conn12  P/N: DTM063S-E007  (hidden comment: Deutsch_DTM_3S_Pin)
Conn18  P/N: DTM062S-E007  (hidden comment: Deutsch_DTM_2S_Pin)
Conn19  P/N: DTM062S-E007  (hidden comment: Deutsch_DTM_2S_Pin)
Conn33  P/N: DTM066S-E007  (hidden comment: Deutsch_DTM_6S_Pin)
Conn65  P/N: Unknown  (hidden comment: Deutsch_DTM_2S_Pin)
J35  ASSD61023PN
J36  8STA62235SN
J37  8STA02435PN  (value not drawn)
R9  120

### Ports
COCKPIT E-STOP (bidir), FIREWALL (bidir), Front Box Connector (bidir), INERTIA SW (bidir), PEDAL BOX DASH (bidir), SAGL (in)

### Nets
APPS1.GND: J35.11(Pin_11) J36.10(Pin_10)
APPS1.PWR: J35.9(Pin_9) J36.9(Pin_9)
APPS1.SHLD: J35.12(Pin_12) J36.19(Pin_19)
APPS1.SIG: Conn8#1.23 J35.10(Pin_10) J36.18(Pin_18)
APPS2.GND: J35.15(Pin_15) J36.12(Pin_12)
APPS2.PWR: J35.13(Pin_13) J36.11(Pin_11)
APPS2.SHLD: J35.16(Pin_16) J36.21(Pin_21)
APPS2.SIG: Conn8#1.22 J35.14(Pin_14) J36.20(Pin_20)
BMS.LED.K: Conn8#1.16
BPS.FRONT.SIG: Conn8#1.25
BPS.FRONT.VCU: J35.6(Pin_6) J36.16(Pin_16)
BPS.REAR.SIG: Conn8#1.24
BPS.REAR.VCU: J35.7(Pin_7) J36.17(Pin_17)
BPS.VCU.SHLD: J35.8(Pin_8) J36.8(Pin_8)
BSPD.CT.GND: Conn33.5
BSPD.CT.PWR: Conn33.3
BSPD.CT.SHLD: Conn33.6
BSPD.CUR_SEN.GND: Conn8#1.29
BSPD.CUR_SEN.PWR: Conn8#1.28
BSPD.GND: J35.2(Pin_2) J36.2(Pin_2)
BSPD.PWR: Conn8#1.13 J35.1(Pin_1) J36.1(Pin_1) J36.35(Pin_35)
BSPD.SDC.STATUS: J35.5(Pin_5) J36.3(Pin_3)
CAN.F.GND: J35.18(Pin_18) J36.7(Pin_7) J36.23(Pin_23)
CAN.F.H: J35.19(Pin_19) J36.14(Pin_14) J36.24(Pin_24)
CAN.F.L: J35.20(Pin_20) J36.15(Pin_15) J36.34(Pin_34)
CAN.F.PWR: J35.17(Pin_17) J36.6(Pin_6) J36.22(Pin_22)
CT.SIG: Conn8#1.3 Conn33.4
CT.VCU: J35.3(Pin_3) J36.5(Pin_5)
CT.VCU.SHLD: J35.4(Pin_4) J36.4(Pin_4)
DASH.GND: Conn8#1.34 J36.25(Pin_25) J36.26(Pin_26) J36.27(Pin_27) J36.28(Pin_28) J36.29(Pin_29)
DASH.PWR: Conn8#1.4 J36.30(Pin_30) J36.31(Pin_31) J36.32(Pin_32) J36.33(Pin_33)
DRS.BUTTON.GND: Conn8#1.11
IMD.LED.K: Conn8#1.17
L120.5V.AUX: Conn8#1.26
L120.8V.AUX: Conn8#1.37
L120.AGND: Conn8#1.41
L120.DAMPER.L: Conn8#1.40
L120.DAMPER.R: Conn8#1.39
R2D.BUTTON.GND: Conn8#1.12
R2D.LED.K: Conn8#1.15
SAGL.GND: Conn12.3 J37.45(Pin_45)
SAGL.PWR: Conn12.1 J37.48(Pin_48)
SAGL.SHLD: J37.47(Pin_47)
SAGL.SIG: Conn8#1.30 Conn12.2 J37.46(Pin_46)
SDC.DASH: Conn18.2 Conn19.1
SDC.FRONT: Conn8#1.6 Conn33.1
SDC.INERTIA: Conn19.2 Conn33.2
SDC.LATCHING: Conn8#1.5 Conn18.1
TSAL.GREEN.DASH.LED.K: Conn8#1.14
NetConn65_1: Conn65.1 R9.1
NetConn65_2: Conn65.2 R9.2

Not connected (* = marked no-connect by the designer): Conn8#1 1 2* 7 8 9 10 18* 19* 20 21 27 31 32 33 35 36 38 42* 43* 44* 45* 46* 47*; J35 21(Pin_21) 22(Pin_22) 23(Pin_23); J36 13(Pin_13) 36(Pin_36) 37(Pin_37) 38(Pin_38) 39(Pin_39) 40(Pin_40) 41(Pin_41) 42(Pin_42) 43(Pin_43) 44(Pin_44) 45(Pin_45) 46(Pin_46) 47(Pin_47) 48(Pin_48) 49(Pin_49) 50(Pin_50); J37 1(Pin_1) 2(Pin_2) 3(Pin_3) 4(Pin_4) 5(Pin_5) 6(Pin_6) 7(Pin_7) 8(Pin_8) 9(Pin_9) 10(Pin_10) 11(Pin_11) 12(Pin_12) 13(Pin_13) 14(Pin_14) 15(Pin_15) 16(Pin_16) 17(Pin_17) 18(Pin_18) 19(Pin_19) 20(Pin_20) 21(Pin_21) 22(Pin_22) 23(Pin_23) 24(Pin_24) 25(Pin_25) 26(Pin_26) 27(Pin_27) 28(Pin_28) 29(Pin_29) 30(Pin_30) 31(Pin_31) 32(Pin_32) 33(Pin_33) 34(Pin_34) 35(Pin_35) 36(Pin_36) 37(Pin_37) 38(Pin_38) 39(Pin_39) 40(Pin_40) 41(Pin_41) 42(Pin_42) 43(Pin_43) 44(Pin_44) 49(Pin_49) 50(Pin_50)

### Buses and harness runs
bus {L120.AUX.SIG}

### Notes on the sheet
- (near Conn8#1) Pin 2 stuck,
  swap to 36
- Splice with switch here?
- (near Conn8#1) 1, 4, 5, 6, 34
- Shield for CAN?
- (near Conn8#1) -->
- (near Conn8#1) SAGL.EXC etc re-used
  for L120 5V sensor
  power/gnd
  TODO: make bus
- -->
- SPLICE CLOSE
  TO CONN
- Terminate CAN at dash?
- If including pressure sensor
- Splice Power too?
- I cannot be asked
  to make a 1x100
- Labels drawn without touching a wire or pin: CAN.S.HIGH, CAN.S.LOW, DRS.BUTTON.PWR, RTDS.GND, RTDS.PWR, TS.DETECTED.DASH.A, TSAL.DASH.PWR
- 1
- 2
- 3
- 4
- 5
- 6
- 7
- 8
- 9
- 10
- 11
- A
- B
- C
- D
- E
- F
- G
- H
- Title:
- File: loom-front-new.kicad_sch
- Sheet: /
- KiCad E.D.A.  kicad (5.1.4)-1
- Size: A2
- Date:
- Rev:
- Id: 1/1

### Library data of the parts
J35 = Conn_01x23: Description: Generic connector, single row, 01x23, script generated (kicad-library-utils/schlib/autogen/connector/); Value: ASSD61023PN
J36 J37 = Conn_01x50: Description: "Generic connector, single row, 01x50, script generated"
  J36: Value: 8STA62235SN
  J37: Value: 8STA02435PN
R9 = R_Small: Description: Resistor, small symbol; Value: 120
Conn8#1 = AMPHENOL-47P-Recepticle: Value: AMPHENOL-47P-Recepticle
Conn12 = Deutsch_DTM_3S_Pin: Value: Deutsch_DTM_3S_Pin
Conn18 Conn19 Conn65 = Deutsch_DTM_2S_Pin: Value: Deutsch_DTM_2S_Pin
Conn33 = Deutsch_DTM_6S_Pin: Value: Deutsch_DTM_6S_Pin

## Sheet device-e-stop.SchDoc
size 297 x 209 mm
Used 3 times, as channels DEVICE - E-STOP - COCKPIT, DEVICE - E-STOP - LHS, DEVICE - E-STOP - RHS. Parts and nets are listed once, with the designators drawn on the sheet.
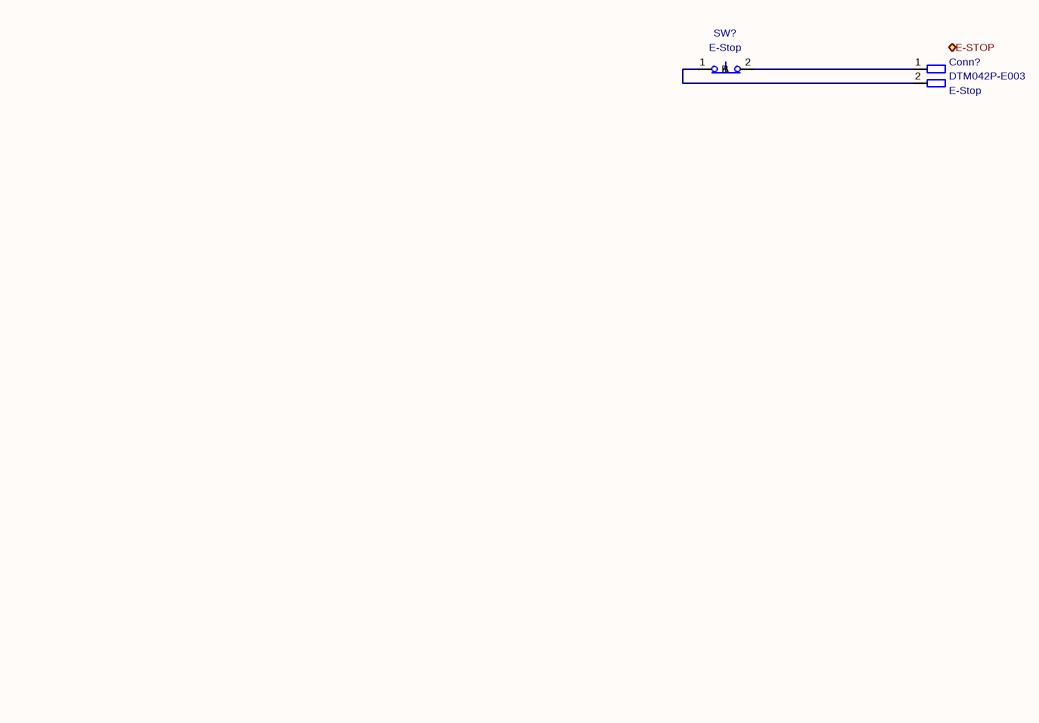
[diagram p11: device-e-stop.SchDoc]

### Parts
Conn?  P/N: DTM042P-E003  Conn Name: E-Stop  (hidden comment: Deutsch_DTM_2P_Pin)
SW?  E-Stop

### Ports
E-STOP (bidir)

### Nets
NetConn?_1: Conn?.1 SW?.2(B)
NetConn?_2: Conn?.2 SW?.1(A)

### Channels
DEVICE - E-STOP - COCKPIT: designators end in _DEVICE_-_E-STOP_-_COCKPIT; ports E-STOP=E-STOP_DEVICE - E-STOP - COCKPIT
DEVICE - E-STOP - LHS: designators end in _DEVICE_-_E-STOP_-_LHS; ports E-STOP=E-STOP_DEVICE - E-STOP - LHS
DEVICE - E-STOP - RHS: designators end in _DEVICE_-_E-STOP_-_RHS; ports E-STOP=E-STOP_DEVICE - E-STOP - RHS

### Notes on the sheet
- 1
- 2
- 3
- 4
- 5
- 6
- A
- B
- C
- D
- Title: DEVICE - E-STOP
- File: device-e-stop.kicad_sch
- Sheet: /
- KiCad E.D.A.  kicad (5.1.4)-1
- Size: A4
- Date:
- Rev:
- Id: 1/1

### Library data of the parts
SW? = SW_Push_Open: Value: E-Stop
Conn? = Deutsch_DTM_2P_Pin: Value: Deutsch_DTM_2P_Pin

## Sheet device-inverter.SchDoc
size 297 x 209 mm
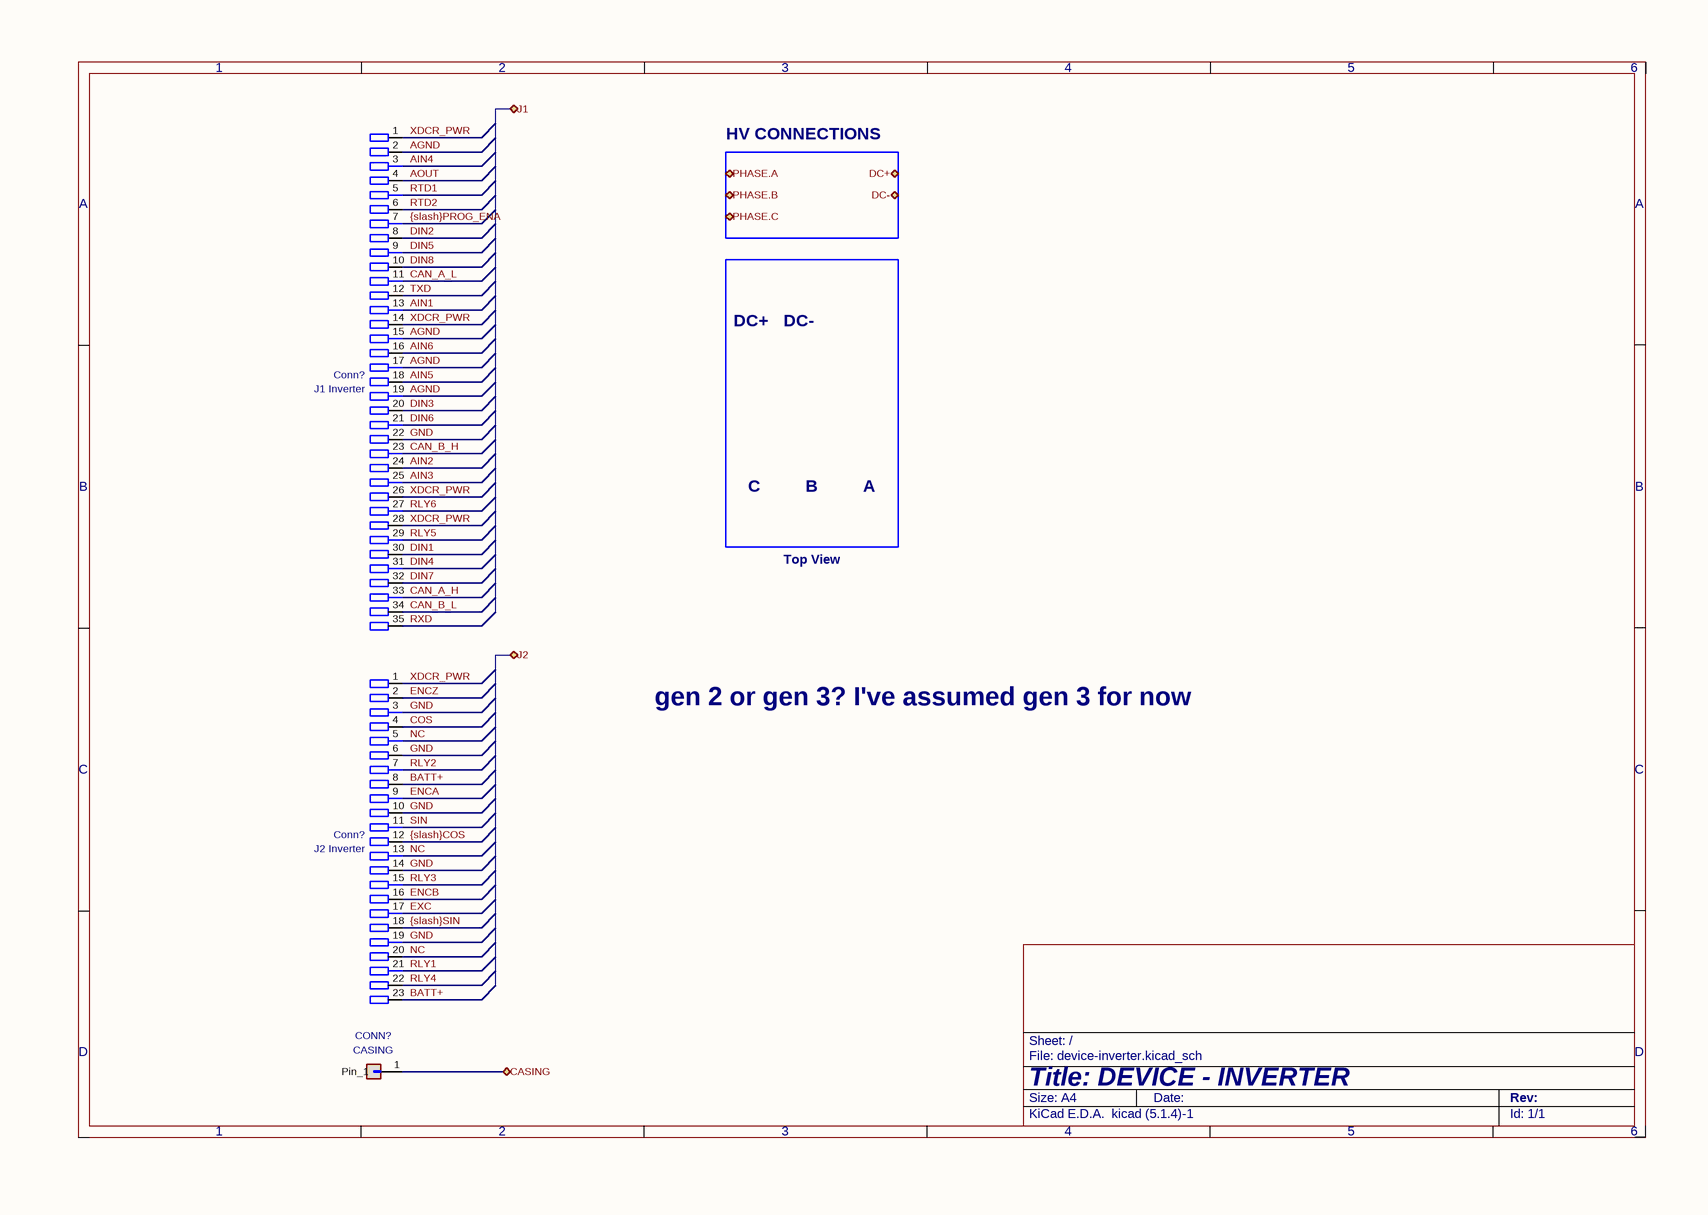
[diagram p12: device-inverter.SchDoc]

### Parts
(Parts that share a designator on the sheet are numbered #1, #2 ... from top to bottom, then left to right.)
Conn?#5  J1 Inverter
Conn?#6  J2 Inverter
CONN?#7  CASING

### Ports
CASING (bidir), DC+ (bidir), DC- (bidir), J1 (bidir), J2 (bidir), PHASE.A (bidir), PHASE.B (bidir), PHASE.C (bidir)

### Nets
AGND: Conn?#5.2 Conn?#5.15 Conn?#5.17 Conn?#5.19
AIN1: Conn?#5.13
AIN2: Conn?#5.24
AIN3: Conn?#5.25
AIN4: Conn?#5.3
AIN5: Conn?#5.18
AIN6: Conn?#5.16
AOUT: Conn?#5.4
BATT+: Conn?#6.8 Conn?#6.23
CAN_A_H: Conn?#5.33
CAN_A_L: Conn?#5.11
CAN_B_H: Conn?#5.23
CAN_B_L: Conn?#5.34
CASING: CONN?#7.1(Pin_1) ; port CASING
COS: Conn?#6.4
DIN1: Conn?#5.30
DIN2: Conn?#5.8
DIN3: Conn?#5.20
DIN4: Conn?#5.31
DIN5: Conn?#5.9
DIN6: Conn?#5.21
DIN7: Conn?#5.32
DIN8: Conn?#5.10
ENCA: Conn?#6.9
ENCB: Conn?#6.16
ENCZ: Conn?#6.2
EXC: Conn?#6.17
GND: Conn?#5.22 Conn?#6.3 Conn?#6.6 Conn?#6.10 Conn?#6.14 Conn?#6.19
NC: Conn?#6.5 Conn?#6.13 Conn?#6.20
RLY1: Conn?#6.21
RLY2: Conn?#6.7
RLY3: Conn?#6.15
RLY4: Conn?#6.22
RLY5: Conn?#5.29
RLY6: Conn?#5.27
RTD1: Conn?#5.5
RTD2: Conn?#5.6
RXD: Conn?#5.35
SIN: Conn?#6.11
TXD: Conn?#5.12
XDCR_PWR: Conn?#5.1 Conn?#5.14 Conn?#5.26 Conn?#5.28 Conn?#6.1
{slash}COS: Conn?#6.12
{slash}PROG_ENA: Conn?#5.7
{slash}SIN: Conn?#6.18

### Notes on the sheet
- HV CONNECTIONS
- DC+
- DC-
- C
- B
- A
- Top View
- gen 2 or gen 3?
  I've assumed gen 3 for now
- 1
- 2
- 3
- 4
- 5
- 6
- D
- Title: DEVICE - INVERTER
- File: device-inverter.kicad_sch
- Sheet: /
- KiCad E.D.A.  kicad (5.1.4)-1
- Size: A4
- Date:
- Rev:
- Id: 1/1

### Library data of the parts
CONN?#7 = Conn_01x01: Value: CASING
Conn?#5 = J1 Inverter: Value: J1 Inverter
Conn?#6 = J2 Inverter: Value: J2 Inverter

## Sheet device-tsal.SchDoc
size 297 x 209 mm
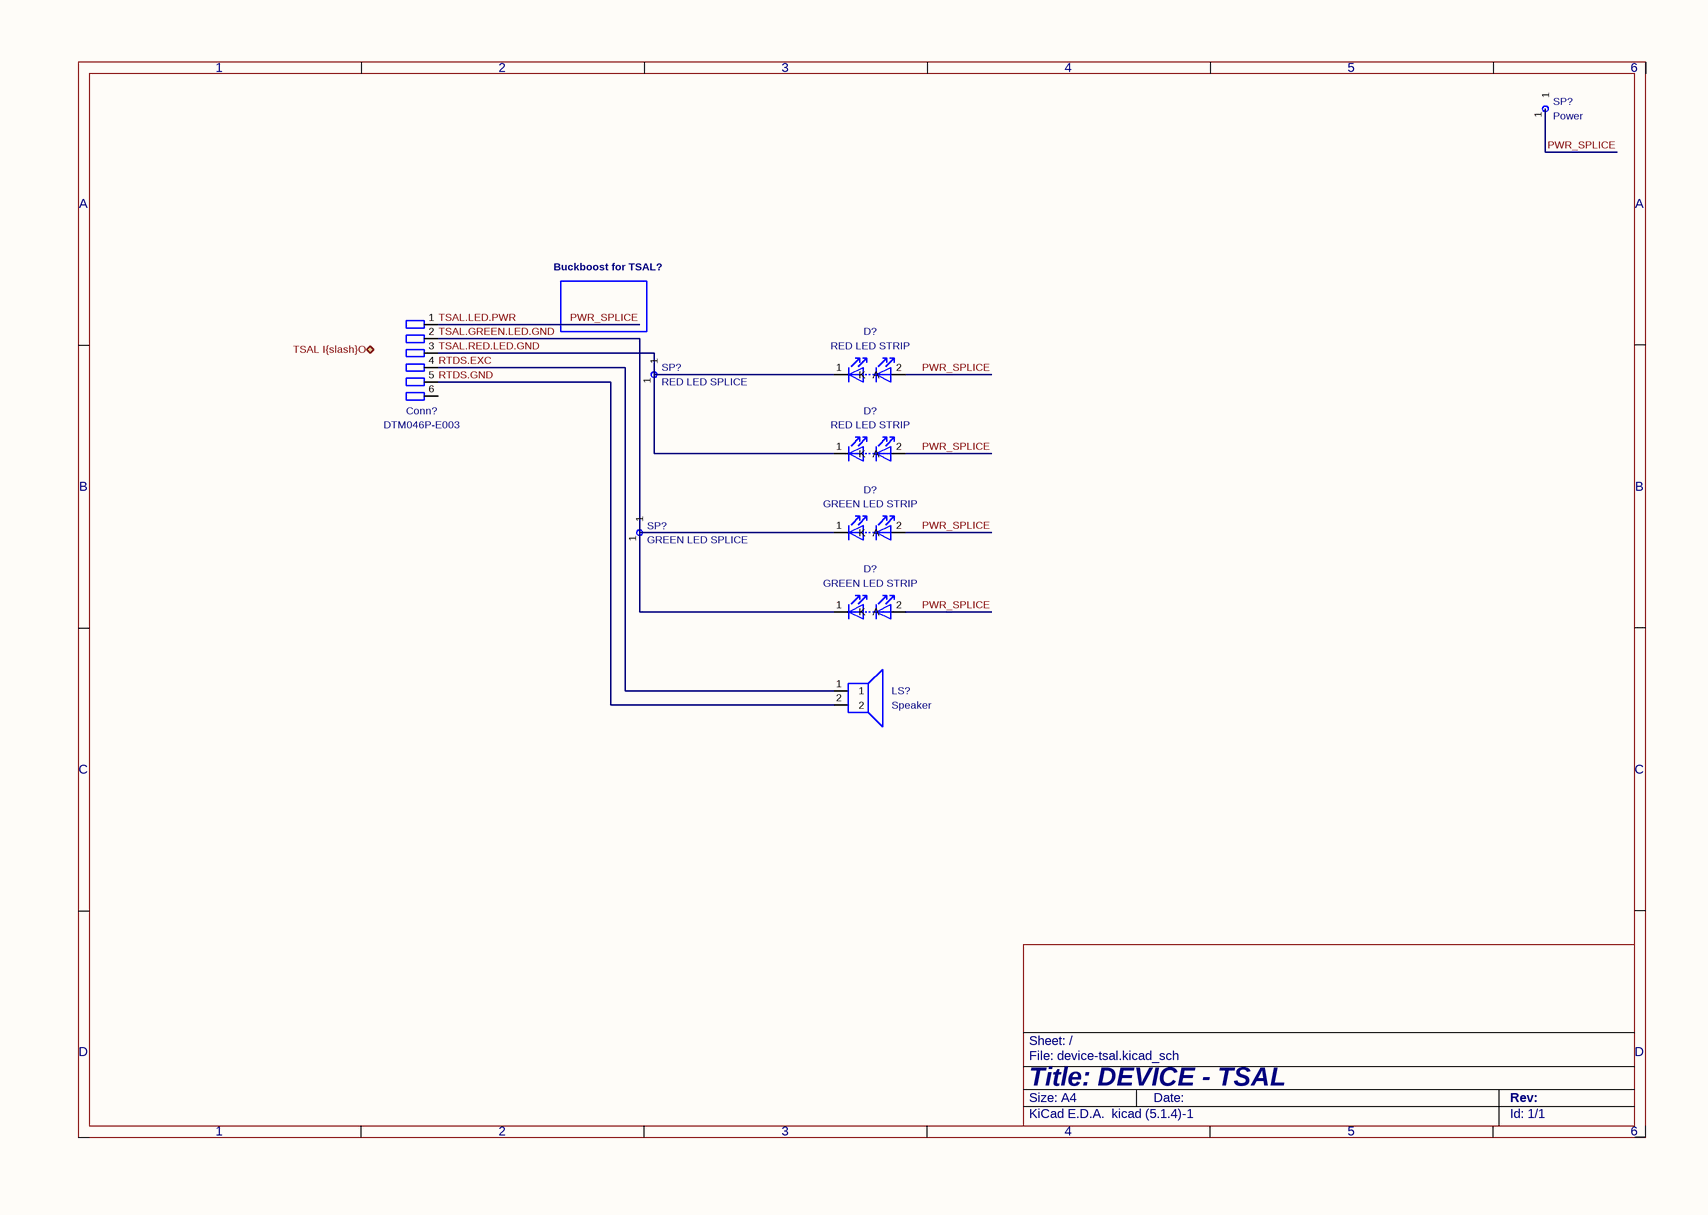
[diagram p13: device-tsal.SchDoc]

### Parts
(Parts that share a designator on the sheet are numbered #1, #2 ... from top to bottom, then left to right.)
Conn?#8  P/N: DTM046P-E003  (hidden comment: Deutsch_DTM_6P_Pin)
D?#1  RED LED STRIP
D?#2  RED LED STRIP
D?#3  GREEN LED STRIP
D?#4  GREEN LED STRIP
LS?  Speaker
SP?#1  Power
SP?#2  RED LED SPLICE
SP?#3  GREEN LED SPLICE

### Ports
TSAL I{slash}O (bidir)

### Nets
PWR_SPLICE: Conn?#8.1 D?#1.2(A) D?#2.2(A) D?#3.2(A) D?#4.2(A) SP?#1.1  [also labelled TSAL.LED.PWR]
RTDS.EXC: Conn?#8.4 LS?.1
RTDS.GND: Conn?#8.5 LS?.2
TSAL.GREEN.LED.GND: Conn?#8.2 D?#3.1(K) D?#4.1(K) SP?#3.1
TSAL.RED.LED.GND: Conn?#8.3 D?#1.1(K) D?#2.1(K) SP?#2.1

Not connected (* = marked no-connect by the designer): Conn?#8 6

### Notes on the sheet
- Buckboost for TSAL?
- 1
- 2
- 3
- 4
- 5
- 6
- A
- B
- C
- D
- Title: DEVICE - TSAL
- File: device-tsal.kicad_sch
- Sheet: /
- KiCad E.D.A.  kicad (5.1.4)-1
- Size: A4
- Date:
- Rev:
- Id: 1/1

### Library data of the parts
D?#1-D?#4 = LED_Series
  D?#1 D?#2: Value: RED LED STRIP
  D?#3 D?#4: Value: GREEN LED STRIP
SP?#1-SP?#3 = TestPoint_Small
  SP?#1: Value: Power
  SP?#2: Value: RED LED SPLICE
  SP?#3: Value: GREEN LED SPLICE
Conn?#8 = Deutsch_DTM_6P_Pin: Value: Deutsch_DTM_6P_Pin
LS? = Speaker: Value: Speaker

## Sheet device-radiator-fan.SchDoc
size 297 x 209 mm
Used 2 times, as channels DEVICE - FAN - RIGHT, DEVICE - FAN - LEFT. Parts and nets are listed once, with the designators drawn on the sheet.
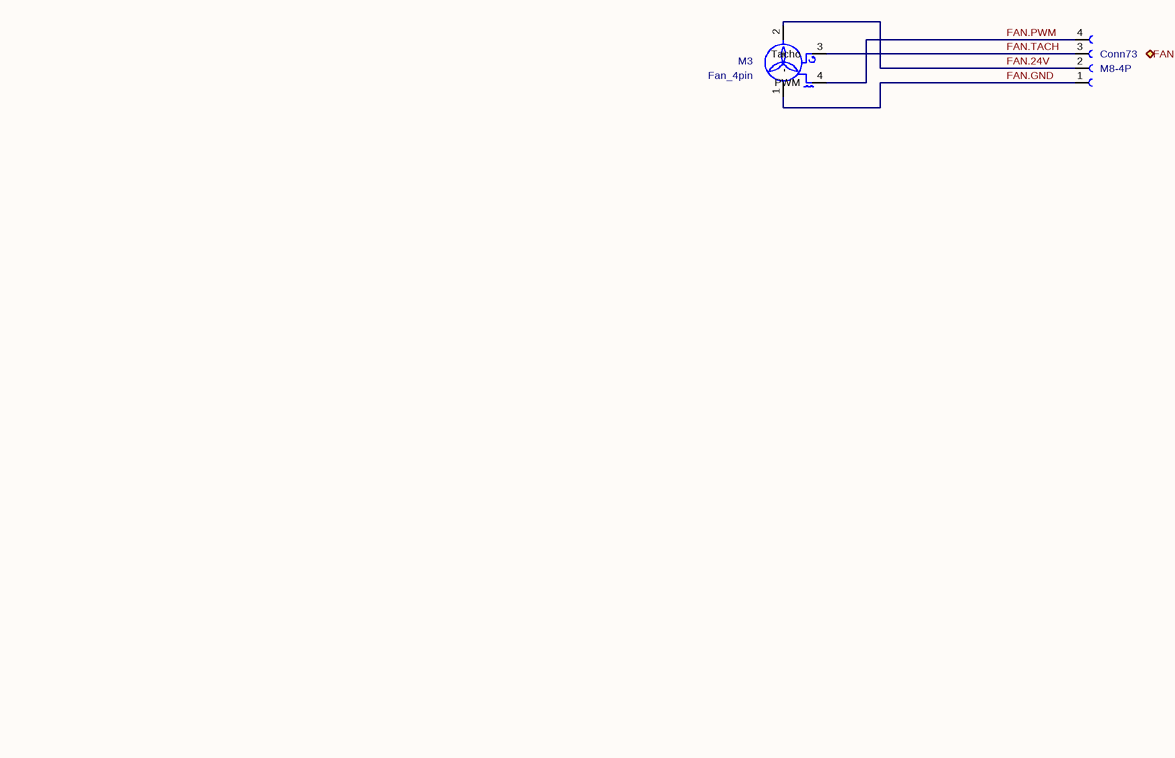
[diagram p14: device-radiator-fan.SchDoc]

### Parts
Conn73  P/N: M8-4P  (hidden comment: Deutsch_DTM_4S_Pin)
M3  Fan_4pin  [FanPinHeader_1x04_P2.54mm_Vertical]

### Ports
FAN (bidir)

### Nets
FAN.24V: Conn73.2 M3.2(+)
FAN.GND: Conn73.1 M3.1(-)
FAN.PWM: Conn73.4 M3.4(PWM)
FAN.TACH: Conn73.3 M3.3(Tacho)

### Channels
DEVICE - FAN - RIGHT: designators end in _DEVICE_-_FAN_-_RIGHT; ports FAN=FAN_DEVICE - FAN - RIGHT
DEVICE - FAN - LEFT: designators end in _DEVICE_-_FAN_-_LEFT; ports FAN=FAN_DEVICE - FAN - LEFT

### Notes on the sheet
- 1
- 2
- 3
- 4
- 5
- 6
- A
- B
- C
- D
- Title: DEVICE - RADIATOR FAN
- File: device-radiator-fan.kicad_sch
- Sheet: /
- KiCad E.D.A.  kicad (5.1.4)-1
- Size: A4
- Date:
- Rev:
- Id: 1/1

### Library data of the parts
M3 = Fan_4pin: Description: Fan, tacho output, PWM input, 4-pin connector; Value: Fan_4pin; Footprint: Connector:FanPinHeader_1x04_P2.54mm_Vertical
Conn73 = Deutsch_DTM_4S_Pin: Value: Deutsch_DTM_4S_Pin

## Sheet device-apps.SchDoc
size 297 x 209 mm
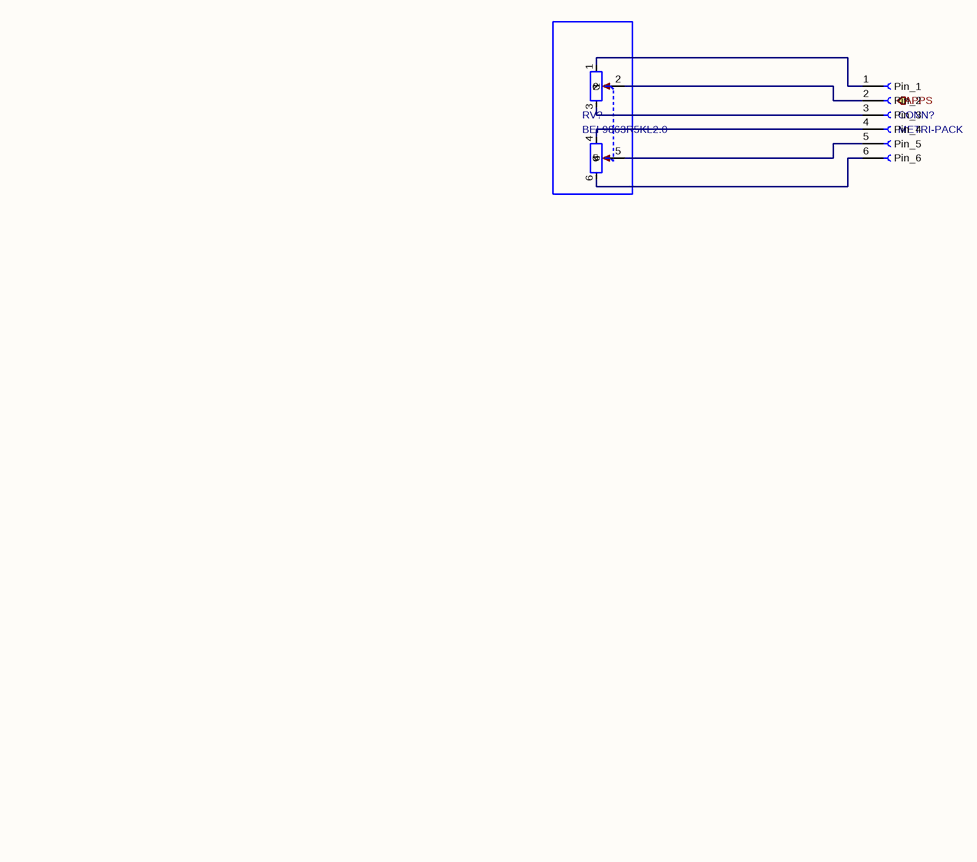
[diagram p15: device-apps.SchDoc]

### Parts
(Parts that share a designator on the sheet are numbered #1, #2 ... from top to bottom, then left to right.)
CONN?#9  METRI-PACK
RV?  BEI 9863R5KL2.0

### Ports
APPS (out)

### Nets
NetCONN?#9_1: CONN?#9.1(Pin_1) RV?.1
NetCONN?#9_2: CONN?#9.2(Pin_2) RV?.2
NetCONN?#9_3: CONN?#9.3(Pin_3) RV?.3
NetCONN?#9_4: CONN?#9.4(Pin_4) RV?.4
NetCONN?#9_5: CONN?#9.5(Pin_5) RV?.5
NetCONN?#9_6: CONN?#9.6(Pin_6) RV?.6

### Notes on the sheet
- 1
- 2
- 3
- 4
- 5
- 6
- A
- B
- C
- D
- Title: DEVICE - APPS
- File: device-apps.kicad_sch
- Sheet: /
- KiCad E.D.A.  kicad (5.1.4)-1
- Size: A4
- Date:
- Rev:
- Id: 1/1

### Library data of the parts
CONN?#9 = Conn_01x06_Socket: Value: METRI-PACK
RV? = R_Potentiometer_Dual: Value: BEI 9863R5KL2.0

## Sheet device-inertia-switch.SchDoc
size 297 x 209 mm
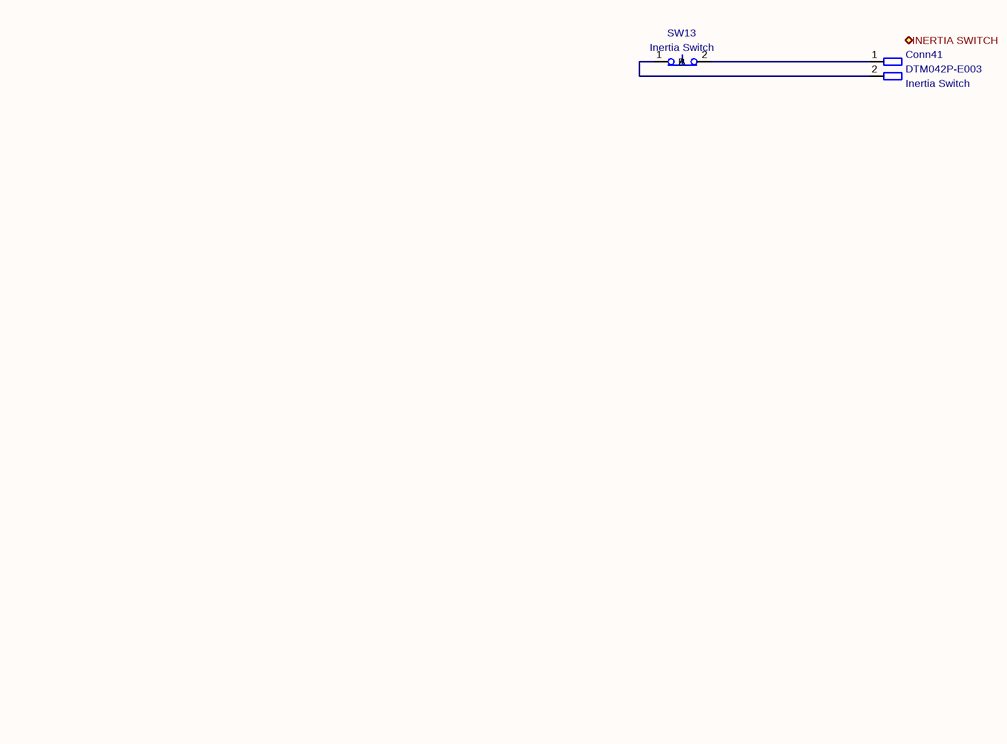
[diagram p16: device-inertia-switch.SchDoc]

### Parts
(Parts that share a designator on the sheet are numbered #1, #2 ... from top to bottom, then left to right.)
Conn41  P/N: DTM042P-E003  Conn Name: Inertia Switch  (hidden comment: Deutsch_DTM_2P_Pin)
SW13#1  Inertia Switch

### Ports
INERTIA SWITCH (bidir)

### Nets
NetConn41_1: Conn41.1 SW13#1.2(B)
NetConn41_2: Conn41.2 SW13#1.1(A)

### Notes on the sheet
- 1
- 2
- 3
- 4
- 5
- 6
- A
- B
- C
- D
- Title: DEVICE - INERTIA SWITCH
- File: device-inertia-switch.kicad_sch
- Sheet: /
- KiCad E.D.A.  kicad (5.1.4)-1
- Size: A4
- Date:
- Rev:
- Id: 1/1

### Library data of the parts
SW13#1 = SW_Push_Open: Value: Inertia Switch
Conn41 = Deutsch_DTM_2P_Pin: Value: Deutsch_DTM_2P_Pin

## Sheet loom-side-panel-left.SchDoc
size 297 x 209 mm
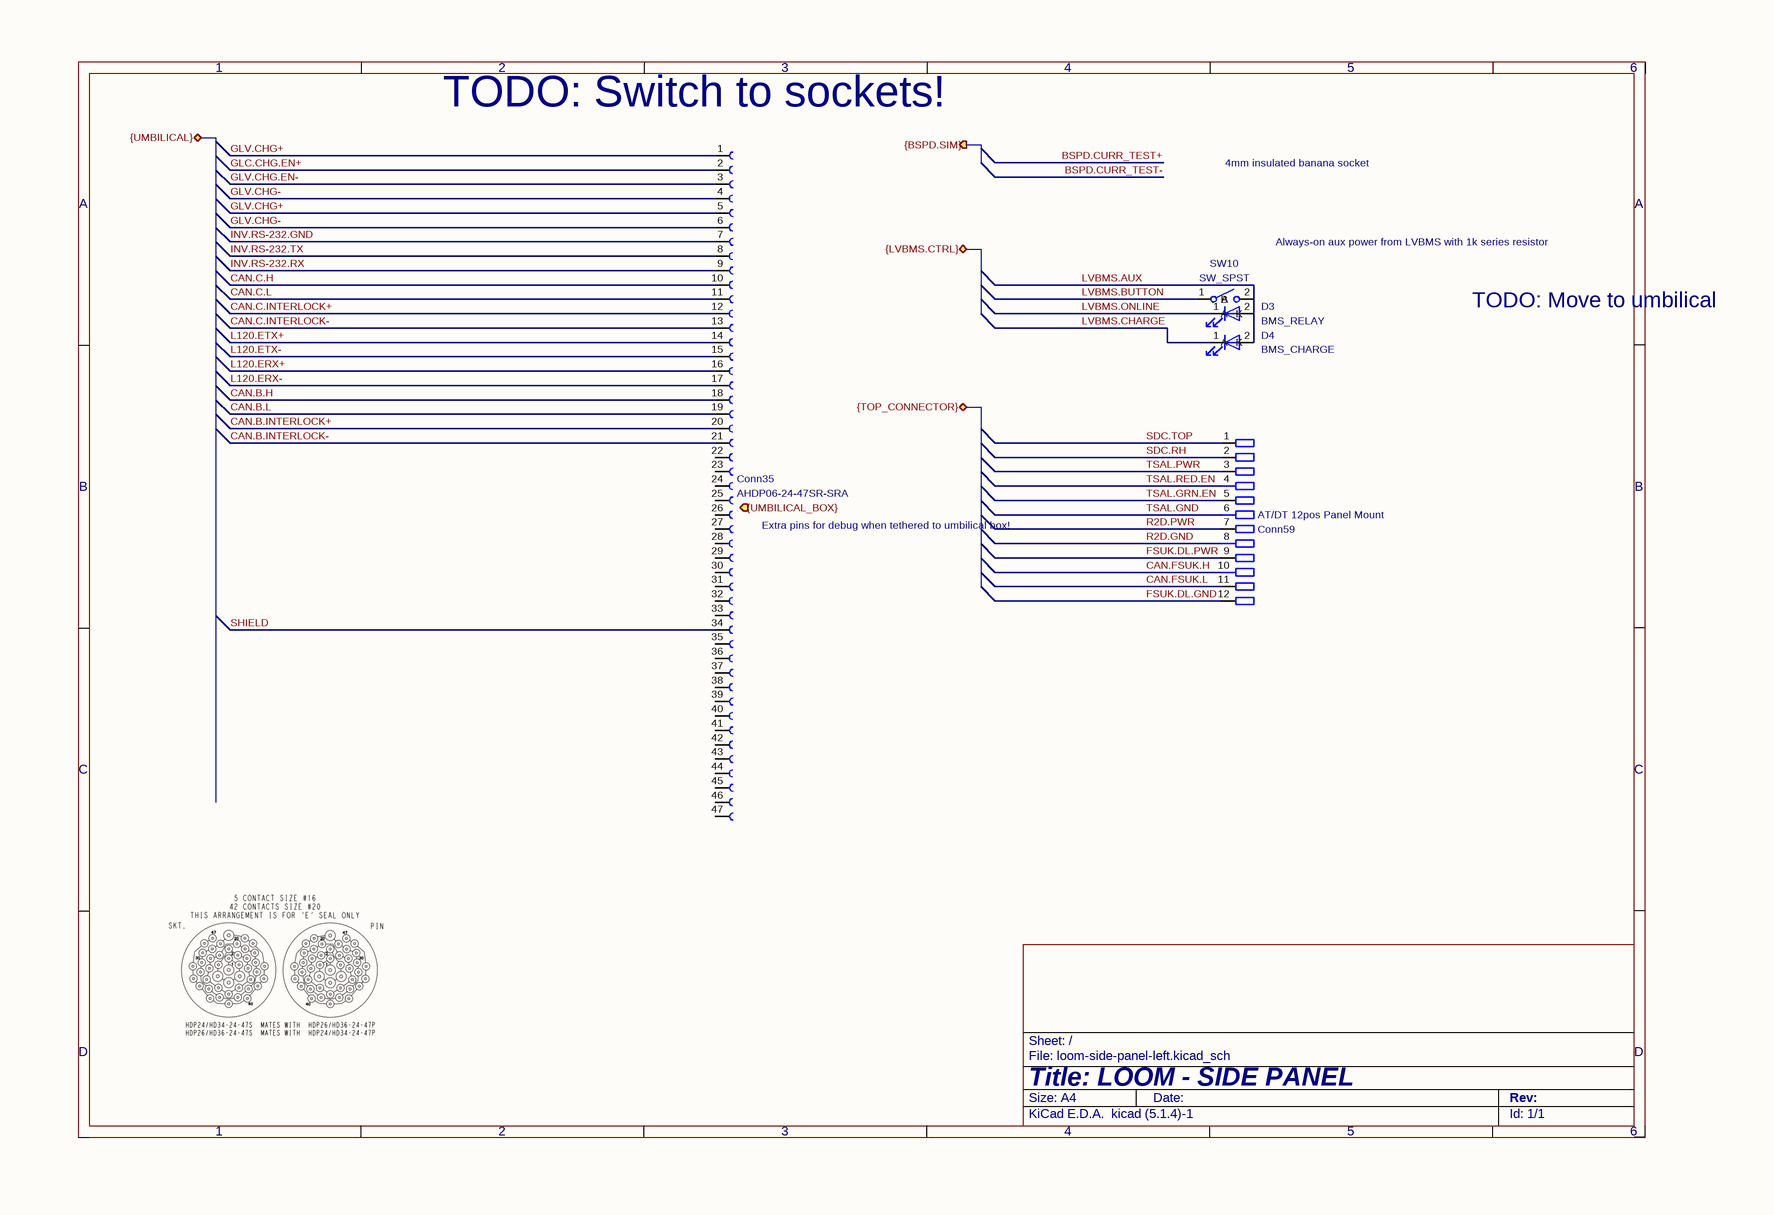
[diagram p17: loom-side-panel-left.SchDoc]

### Parts
Conn35  P/N: AHDP06-24-47SR-SRA  (hidden comment: AMPHENOL-47P-Recepticle)
Conn59  P/N: AT/DT 12pos Panel Mount  (hidden comment: AMPHENOL-21P-Pannel)
D3  BMS_RELAY
D4  BMS_CHARGE
SW10  SW_SPST

### Ports
{BSPD.SIM} (out), {LVBMS.CTRL} (bidir), {TOP_CONNECTOR} (bidir), {UMBILICAL_BOX} (in), {UMBILICAL} (bidir)

### Nets
CAN.B.H: Conn35.18
CAN.B.INTERLOCK+: Conn35.20
CAN.B.INTERLOCK-: Conn35.21
CAN.B.L: Conn35.19
CAN.C.H: Conn35.10
CAN.C.INTERLOCK+: Conn35.12
CAN.C.INTERLOCK-: Conn35.13
CAN.C.L: Conn35.11
CAN.FSUK.H: Conn59.10
CAN.FSUK.L: Conn59.11
FSUK.DL.GND: Conn59.12
FSUK.DL.PWR: Conn59.9
GLC.CHG.EN+: Conn35.2
GLV.CHG+: Conn35.1 Conn35.5
GLV.CHG-: Conn35.4 Conn35.6
GLV.CHG.EN-: Conn35.3
INV.RS-232.GND: Conn35.7
INV.RS-232.RX: Conn35.9
INV.RS-232.TX: Conn35.8
L120.ERX+: Conn35.16
L120.ERX-: Conn35.17
L120.ETX+: Conn35.14
L120.ETX-: Conn35.15
LVBMS.AUX: D3.2(A) D4.2(A) SW10.2(B)
LVBMS.BUTTON: SW10.1(A)
LVBMS.CHARGE: D4.1(K)
LVBMS.ONLINE: D3.1(K)
R2D.GND: Conn59.8
R2D.PWR: Conn59.7
SDC.RH: Conn59.2
SDC.TOP: Conn59.1
SHIELD: Conn35.34
TSAL.GND: Conn59.6
TSAL.GRN.EN: Conn59.5
TSAL.PWR: Conn59.3
TSAL.RED.EN: Conn59.4

Not connected (* = marked no-connect by the designer): Conn35 22 23 24 25 26 27 28 29 30 31 32 33 35 36 37 38 39 40 41 42 43 44 45 46 47

### Notes on the sheet
- (near Conn35) TODO: Switch to sockets!
- 4mm insulated
  banana socket
- Always-on
  aux power
  from LVBMS
  with 1k
  series resistor
- TODO: Move to umbilical
- (near Conn35) Extra pins for
  debug when tethered
  to umbilical box!
- 1
- 2
- 3
- 4
- 5
- 6
- A
- B
- C
- D
- Title: LOOM - SIDE PANEL
- File: loom-side-panel-left.kicad_sch
- Sheet: /
- KiCad E.D.A.  kicad (5.1.4)-1
- Size: A4
- Date:
- Rev:
- Id: 1/1

### Library data of the parts
Conn59 = Deutsch_DTM_12P_Pin: Value: AMPHENOL-21P-Pannel
D3 D4 = LED: Description: Light emitting diode
  D3: Value: BMS_RELAY
  D4: Value: BMS_CHARGE
SW10 = SW_SPST: Description: Single Pole Single Throw (SPST) switch; Value: SW_SPST
Conn35 = AMPHENOL-47P-Recepticle: Value: AMPHENOL-47P-Recepticle

## Sheet loom-top.SchDoc
size 297 x 209 mm
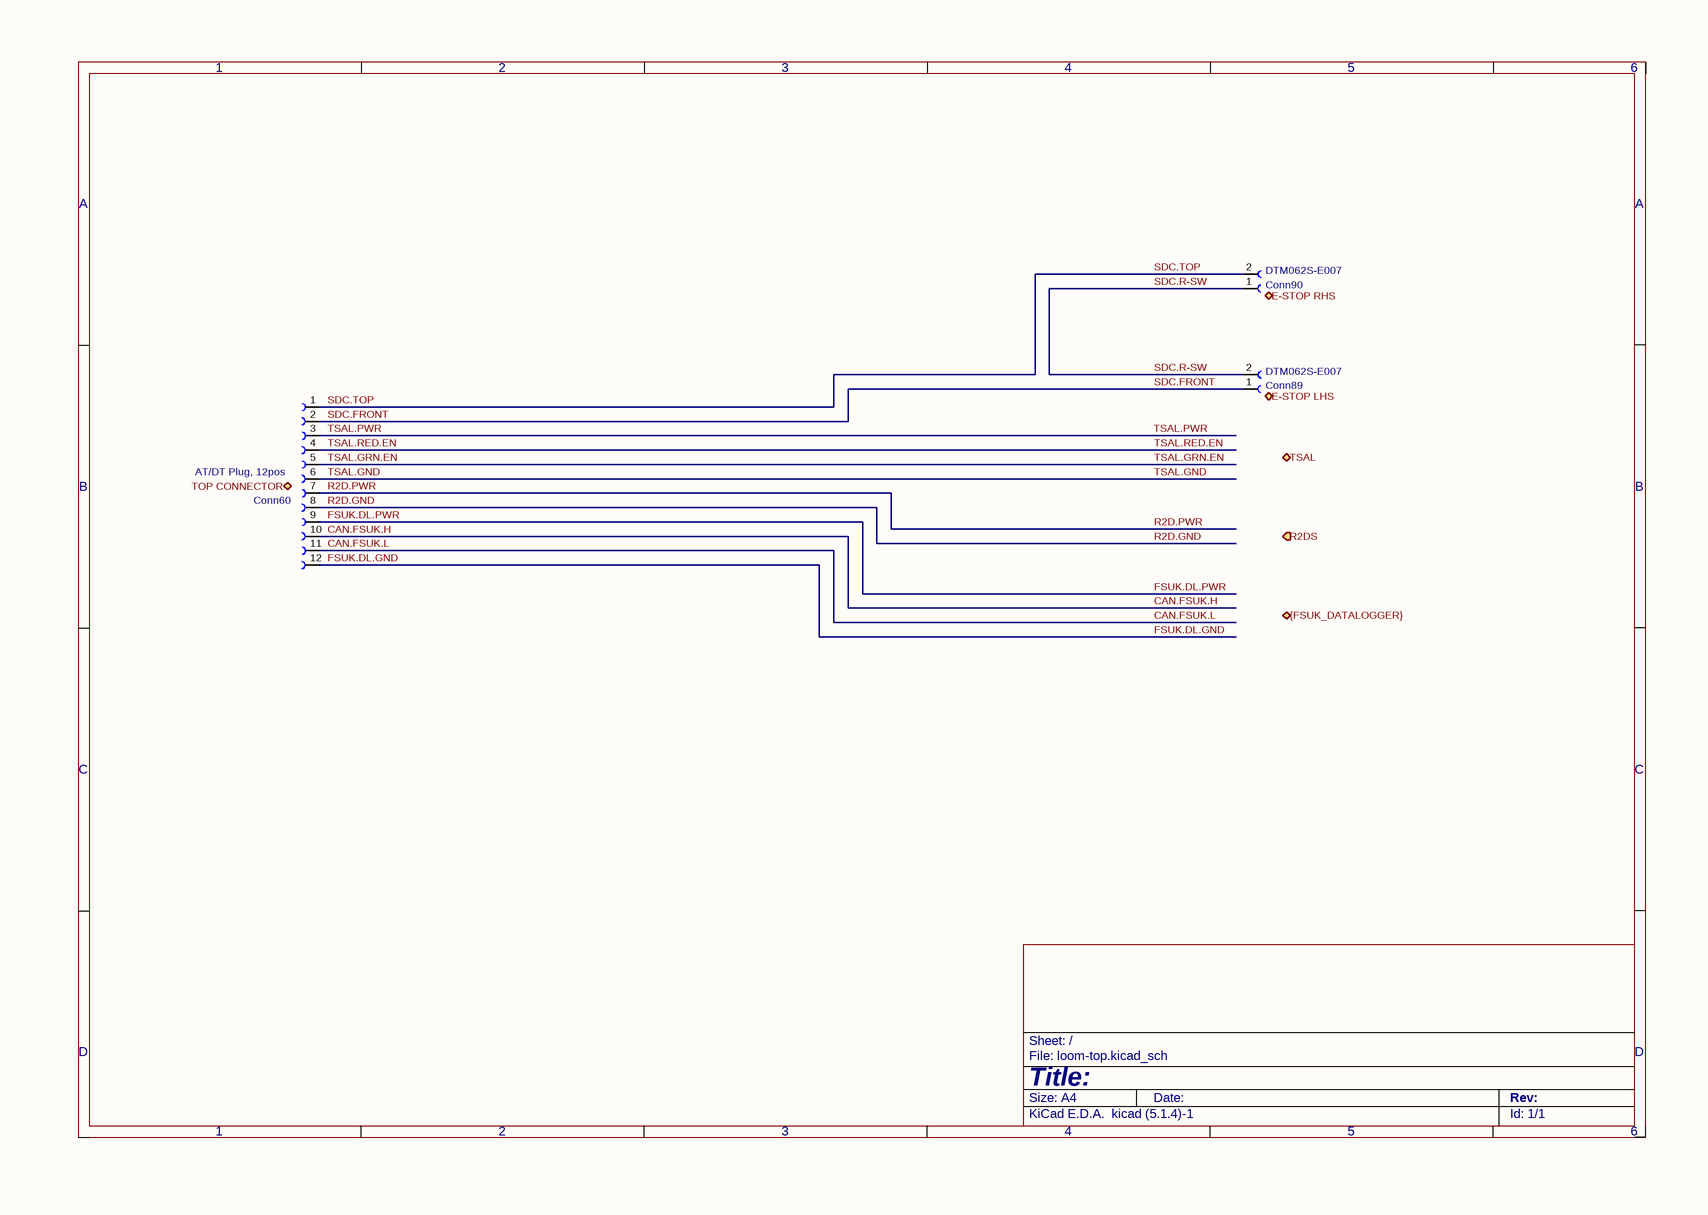
[diagram p18: loom-top.SchDoc]

### Parts
(Parts that share a designator on the sheet are numbered #1, #2 ... from top to bottom, then left to right.)
Conn60  P/N: AT/DT Plug, 12pos  (hidden comment: Deutsch_DTM_12S_Pin)
Conn89#1  P/N: DTM062S-E007  (hidden comment: Deutsch_DTM_2S_Pin)
Conn90#1  P/N: DTM062S-E007  (hidden comment: Deutsch_DTM_2S_Pin)

### Ports
E-STOP LHS (bidir), E-STOP RHS (bidir), R2DS (in), TOP CONNECTOR (bidir), TSAL (bidir), {FSUK_DATALOGGER} (bidir)

### Nets
CAN.FSUK.H: Conn60.10
CAN.FSUK.L: Conn60.11
FSUK.DL.GND: Conn60.12
FSUK.DL.PWR: Conn60.9
R2D.GND: Conn60.8
R2D.PWR: Conn60.7
SDC.FRONT: Conn60.2 Conn89#1.1
SDC.R-SW: Conn89#1.2 Conn90#1.1
SDC.TOP: Conn60.1 Conn90#1.2
TSAL.GND: Conn60.6
TSAL.GRN.EN: Conn60.5
TSAL.PWR: Conn60.3
TSAL.RED.EN: Conn60.4

### Notes on the sheet
- 1
- 2
- 3
- 4
- 5
- 6
- A
- B
- C
- D
- Title:
- File: loom-top.kicad_sch
- Sheet: /
- KiCad E.D.A.  kicad (5.1.4)-1
- Size: A4
- Date:
- Rev:
- Id: 1/1

### Library data of the parts
Conn60 = Deutsch_DTM_12S_Pin: Value: Deutsch_DTM_12S_Pin
Conn89#1 Conn90#1 = Deutsch_DTM_2S_Pin: Value: Deutsch_DTM_2S_Pin

## Sheet LOOM - LV BOX.SchDoc
size 594 x 420 mm
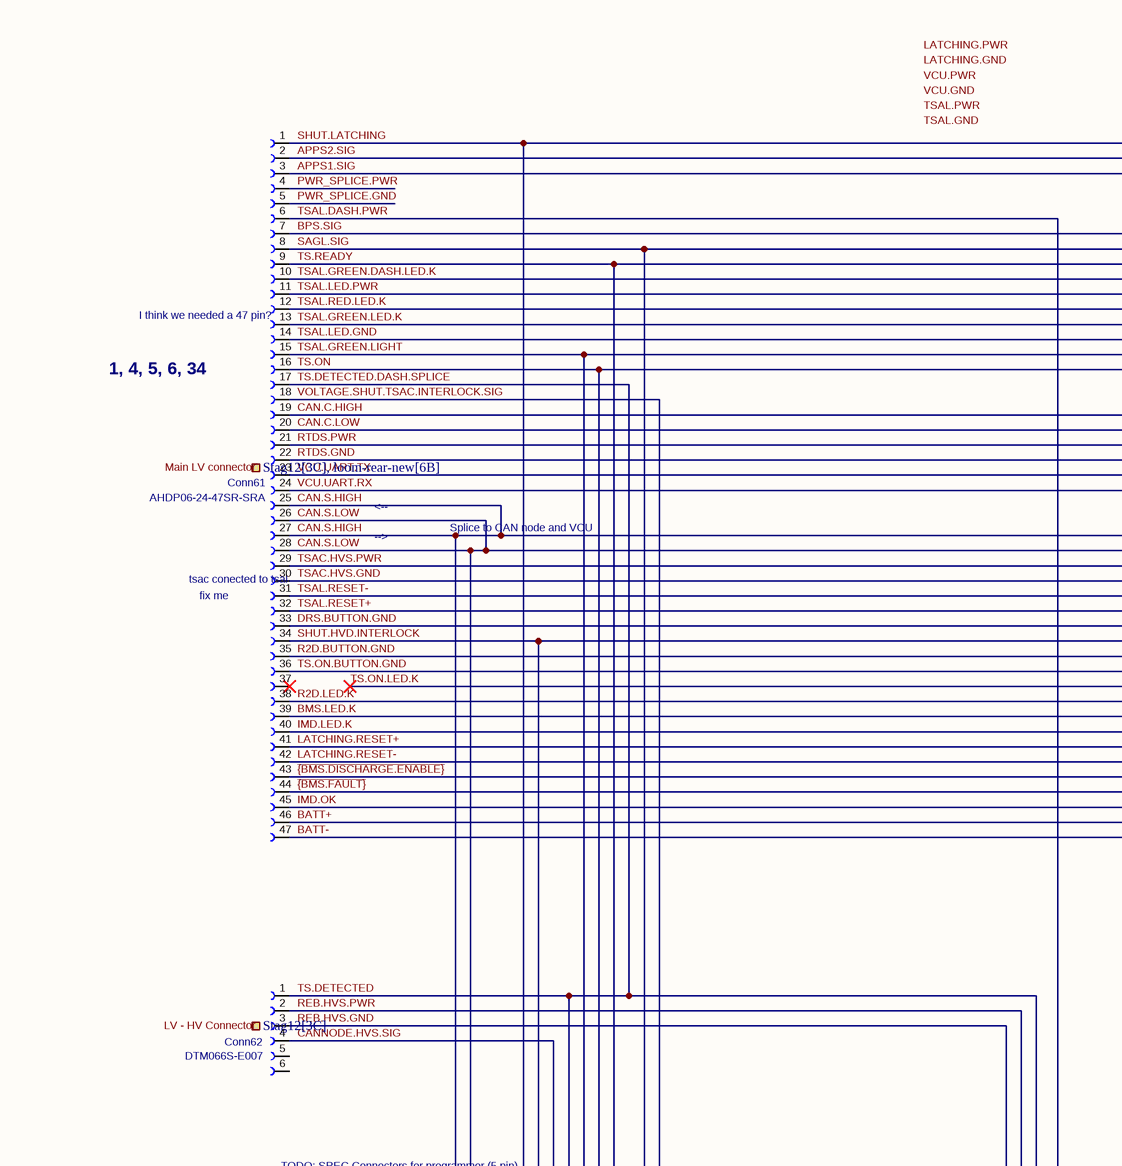
[diagram p19: LOOM - LV BOX.SchDoc, top left]
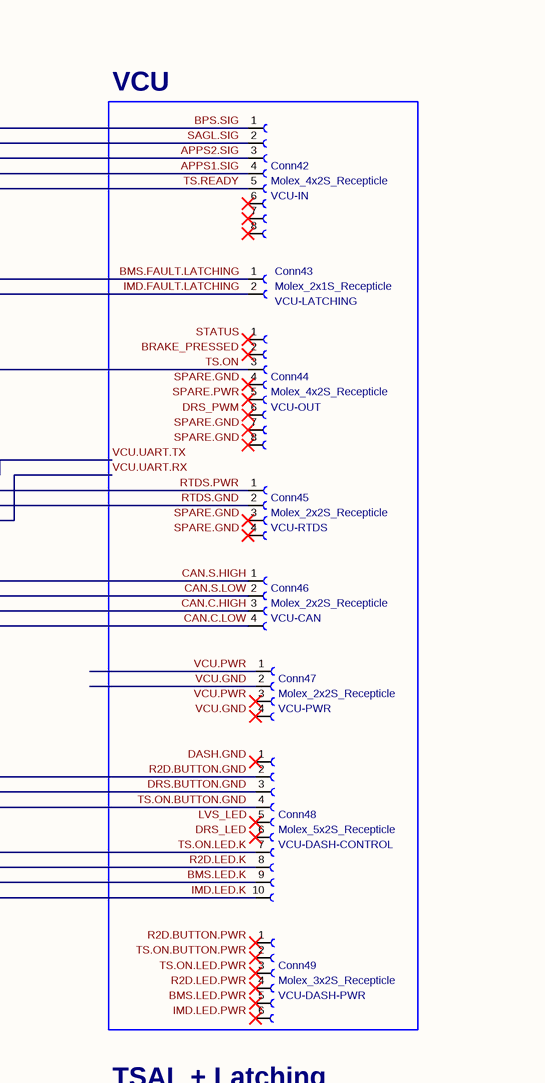
[diagram p20: LOOM - LV BOX.SchDoc, top right]
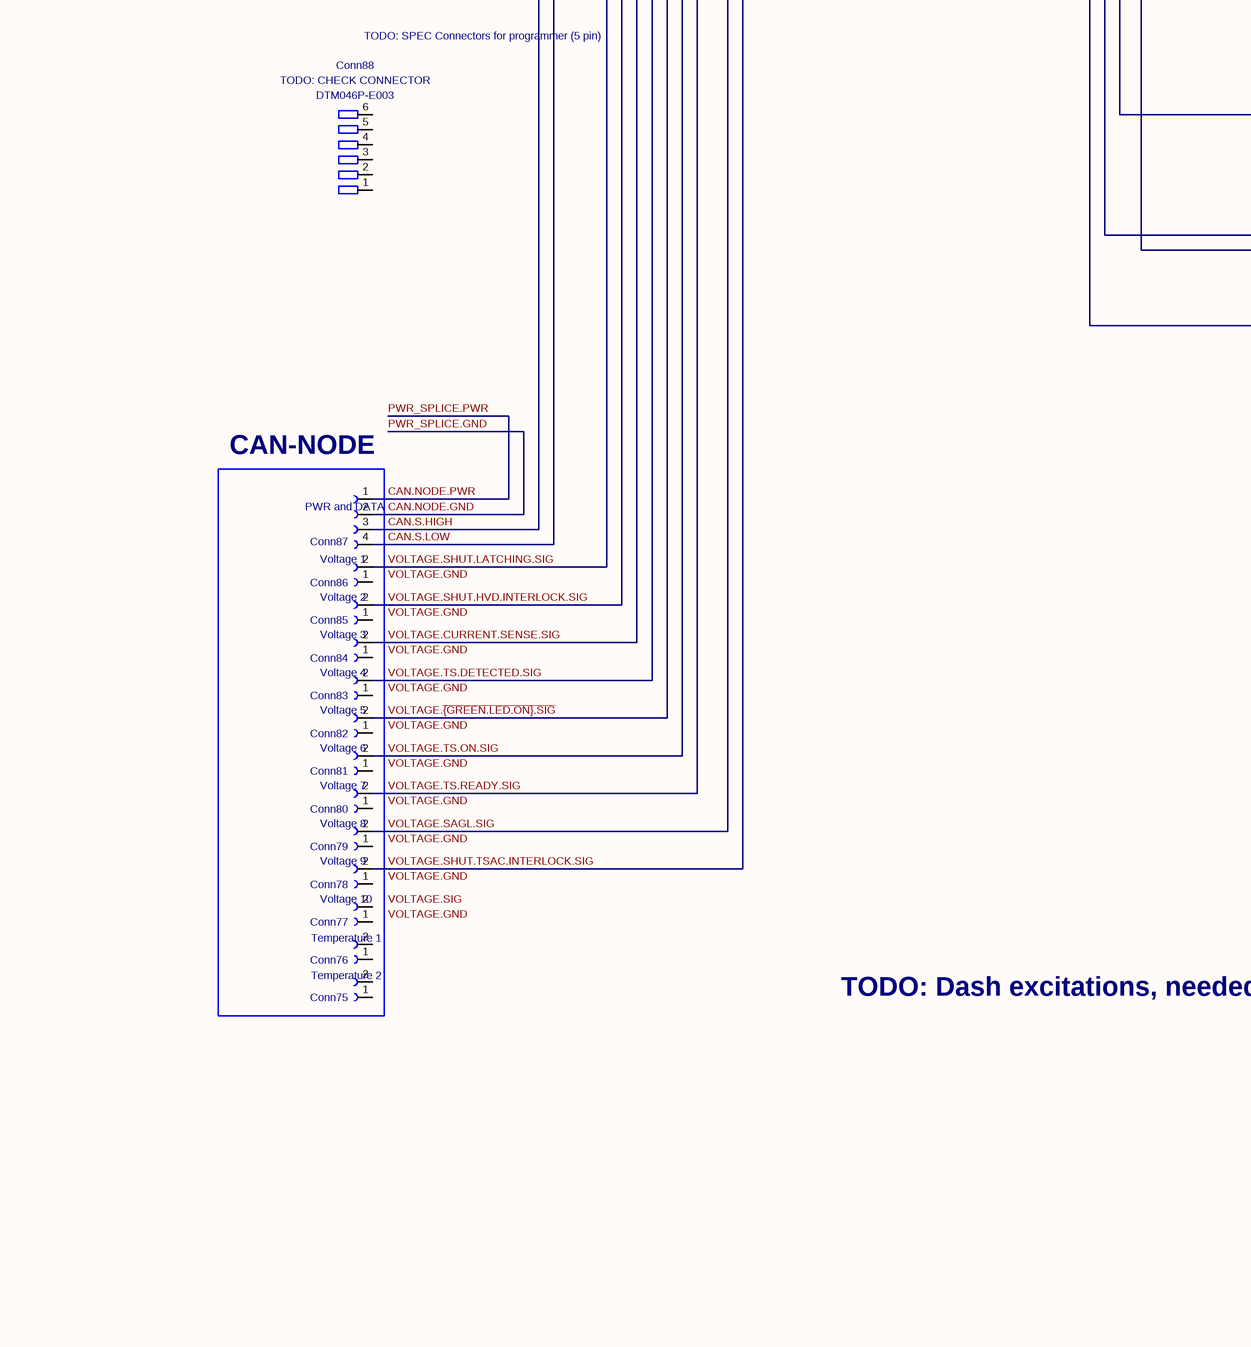
[diagram p21: LOOM - LV BOX.SchDoc, bottom left]
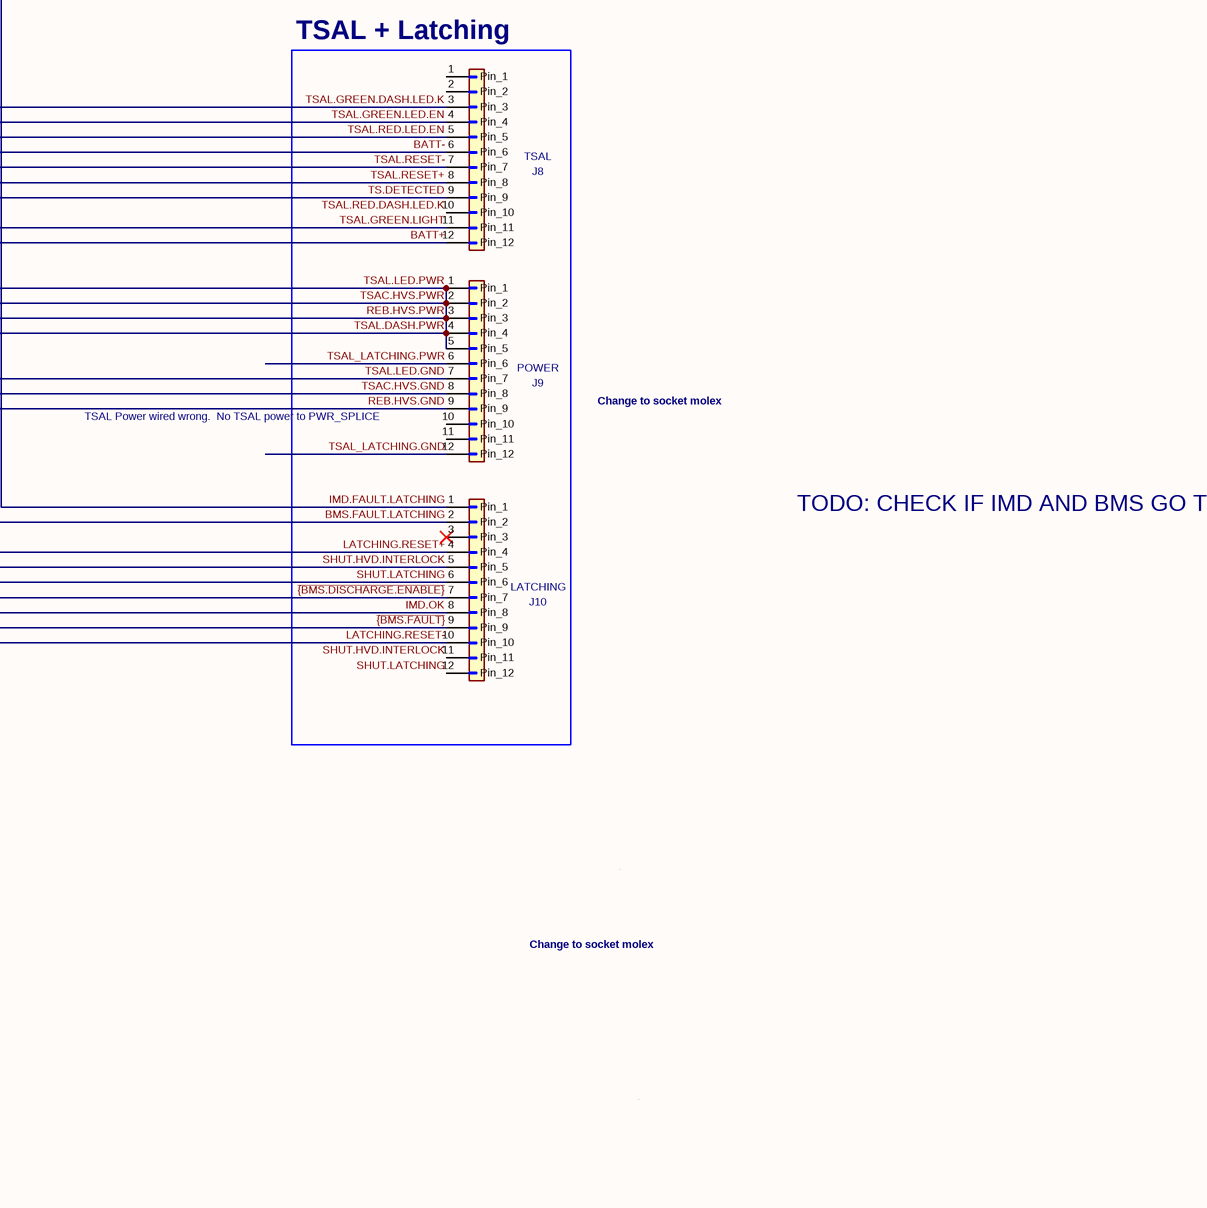
[diagram p22: LOOM - LV BOX.SchDoc, bottom right]

### Parts
Conn42  Conn Name: VCU-IN  (hidden comment: Molex_4x2S_Recepticle)
Conn43  Conn Name: VCU-LATCHING  (hidden comment: Molex_2x1S_Recepticle)
Conn44  Conn Name: VCU-OUT  (hidden comment: Molex_4x2S_Recepticle)
Conn45  Conn Name: VCU-RTDS  (hidden comment: Molex_2x2S_Recepticle)
Conn46  Conn Name: VCU-CAN  (hidden comment: Molex_2x2S_Recepticle)
Conn47  Conn Name: VCU-PWR  (hidden comment: Molex_2x2S_Recepticle)
Conn48  Conn Name: VCU-DASH-CONTROL  (hidden comment: Molex_5x2S_Recepticle)
Conn49  Conn Name: VCU-DASH-PWR  (hidden comment: Molex_3x2S_Recepticle)
Conn61  P/N: AHDP06-24-47SR-SRA  (hidden comment: AMPHENOL-47P-Recepticle)
Conn62  P/N: DTM066S-E007  (hidden comment: Deutsch_DTM_12S_Pin)
Conn75  Molex_2x1S_Recepticle  (value not drawn)
Conn76  Molex_2x1S_Recepticle  (value not drawn)
Conn77  Molex_2x1S_Recepticle  (value not drawn)
Conn78  Molex_2x1S_Recepticle  (value not drawn)
Conn79  Molex_2x1S_Recepticle  (value not drawn)
Conn80  Molex_2x1S_Recepticle  (value not drawn)
Conn81  Molex_2x1S_Recepticle  (value not drawn)
Conn82  Molex_2x1S_Recepticle  (value not drawn)
Conn83  Molex_2x1S_Recepticle  (value not drawn)
Conn84  Molex_2x1S_Recepticle  (value not drawn)
Conn85  Molex_2x1S_Recepticle  (value not drawn)
Conn86  Molex_2x1S_Recepticle  (value not drawn)
Conn87  Molex_4x1S_Recepticle  (value not drawn)
Conn88  P/N: DTM046P-E003  (hidden comment: TODO: CHECK CONNECTOR)
J8  TSAL  [Molex_Micro-Fit_3.0_43045-1200_2x06_P3.00mm_Horizontal]
J9  POWER  [Molex_Micro-Fit_3.0_43045-1200_2x06_P3.00mm_Horizontal]
J10  LATCHING  [Molex_Micro-Fit_3.0_43045-1200_2x06_P3.00mm_Horizontal]

### Blocks framed on the sheet
VCU: Conn42-Conn49
TSAL + Latching: J8-J10
CAN-NODE: Conn75-Conn87

### Ports
LV - HV Connector (in, see Stag12[3C]), Main LV connector (in, see Stag12[3C], loom-rear-new[6B])

### Nets
APPS1.SIG: Conn42.4 Conn61.3
APPS2.SIG: Conn42.3 Conn61.2
BATT+: Conn61.46 J8.12(Pin_12)
BATT-: Conn61.47 J8.6(Pin_6)
BMS.FAULT.LATCHING: Conn43.1 J10.2(Pin_2)
BMS.LED.K: Conn48.9 Conn61.39
BPS.SIG: Conn42.1 Conn61.7
CAN.C.HIGH: Conn46.3 Conn61.19
CAN.C.LOW: Conn46.4 Conn61.20
CAN.NODE.GND: Conn61.5 Conn87.2  [also labelled PWR_SPLICE.GND]
CAN.NODE.PWR: Conn61.4 Conn87.1  [also labelled PWR_SPLICE.PWR]
CAN.S.HIGH: Conn46.1 Conn61.25 Conn61.27 Conn87.3
CAN.S.LOW: Conn46.2 Conn61.26 Conn61.28 Conn87.4
CANNODE.HVS.SIG: Conn62.4 Conn84.2  [also labelled VOLTAGE.CURRENT.SENSE.SIG]
DRS.BUTTON.GND: Conn48.3 Conn61.33
IMD.FAULT.LATCHING: Conn43.2 J10.1(Pin_1)
IMD.LED.K: Conn48.10 Conn61.40
IMD.OK: Conn61.45 J10.8(Pin_8)
LATCHING.RESET+: Conn61.41 J10.4(Pin_4)
LATCHING.RESET-: Conn61.42 J10.10(Pin_10)
R2D.BUTTON.GND: Conn48.2 Conn61.35
R2D.LED.K: Conn48.8 Conn61.38
REB.HVS.GND: Conn62.3 J9.9(Pin_9)
REB.HVS.PWR: Conn61.6 Conn61.11 Conn61.29 Conn62.2 J9.1(Pin_1) J9.2(Pin_2) J9.3(Pin_3) J9.4(Pin_4) J9.5(Pin_5)  [also labelled TSAC.HVS.PWR, TSAL.DASH.PWR, TSAL.LED.PWR]
RTDS.GND: Conn45.2 Conn61.22
RTDS.PWR: Conn45.1 Conn61.21
SAGL.SIG: Conn42.2 Conn61.8 Conn79.2  [also labelled VOLTAGE.SAGL.SIG]
SHUT.HVD.INTERLOCK: Conn61.34 Conn85.2 J10.5(Pin_5) J10.11(Pin_11)  [also labelled VOLTAGE.SHUT.HVD.INTERLOCK.SIG]
SHUT.LATCHING: Conn61.1 Conn86.2 J10.6(Pin_6) J10.12(Pin_12)  [also labelled VOLTAGE.SHUT.LATCHING.SIG]
TS.DETECTED: Conn61.17 Conn62.1 Conn83.2 J8.9(Pin_9)  [also labelled TS.DETECTED.DASH.SPLICE, VOLTAGE.TS.DETECTED.SIG]
TS.ON: Conn44.3 Conn61.16 Conn81.2  [also labelled VOLTAGE.TS.ON.SIG]
TS.ON.BUTTON.GND: Conn48.4 Conn61.36
TS.ON.LED.K: Conn48.7
TS.READY: Conn42.5 Conn61.9 Conn80.2  [also labelled VOLTAGE.TS.READY.SIG]
TSAC.HVS.GND: Conn61.30 J9.8(Pin_8)
TSAL.GREEN.DASH.LED.K: Conn61.10 J8.3(Pin_3)
TSAL.GREEN.LED.EN: Conn61.13 J8.4(Pin_4)  [also labelled TSAL.GREEN.LED.K]
TSAL.GREEN.LIGHT: Conn61.15 Conn82.2 J8.11(Pin_11)  [also labelled VOLTAGE.~{{GREEN.LED.ON}.SIG}]
TSAL.LED.GND: Conn61.14 J9.7(Pin_7)
TSAL.RED.DASH.LED.K: J8.10(Pin_10)
TSAL.RED.LED.EN: Conn61.12 J8.5(Pin_5)  [also labelled TSAL.RED.LED.K]
TSAL.RESET+: Conn61.32 J8.8(Pin_8)
TSAL.RESET-: Conn61.31 J8.7(Pin_7)
TSAL_LATCHING.GND: J9.12(Pin_12)
TSAL_LATCHING.PWR: J9.6(Pin_6)
VCU.GND: Conn47.2
VCU.PWR: Conn47.1
VCU.UART.RX: Conn61.24
VCU.UART.TX: Conn61.23
VOLTAGE.SHUT.TSAC.INTERLOCK.SIG: Conn61.18 Conn78.2
~{{BMS.DISCHARGE.ENABLE}}: Conn61.43 J10.7(Pin_7)
~{{BMS.FAULT}}: Conn61.44 J10.9(Pin_9)

Not connected (* = marked no-connect by the designer): Conn42 6* 7* 8*; Conn44 1* 2* 4* 5* 6* 7* 8*; Conn45 3* 4*; Conn47 3* 4*; Conn48 1* 5* 6*; Conn49 1* 2* 3* 4* 5* 6*; Conn61 37*; Conn62 5 6; Conn75 1 2; Conn76 1 2; Conn77 1 2; Conn78 1; Conn79 1; Conn80 1; Conn81 1; Conn82 1; Conn83 1; Conn84 1; Conn85 1; Conn86 1; Conn88 1 2 3 4 5 6; J8 1(Pin_1) 2(Pin_2); J9 10(Pin_10) 11(Pin_11); J10 3(Pin_3)*

### Notes on the sheet
- (near Conn61) I think we needed a 47 pin?
- (near Conn61) 1, 4, 5, 6, 34
- (near Conn61) tsac conected to tsal
- -->
- <--
- Splice to CAN node and VCU
- (near Conn61) fix me
- TODO: SPEC Connectors for programmer (5 pin)
- TSAL Power
  wired wrong.
  No TSAL power
  to PWR_SPLICE
- Change to socket molex
- TODO: CHECK IF IMD AND BMS GO TO DASH OR VCU
- (near Conn87) PWR and DATA
- (near Conn86) Voltage 1
- (near Conn84) Voltage 3
- (near Conn85) Voltage 2
- (near Conn82) Voltage 5
- (near Conn83) Voltage 4
- (near Conn81) Voltage 6
- (near Conn80) Voltage 7
- (near Conn78) Voltage 9
- (near Conn79) Voltage 8
- (near Conn76) Temperature 1
- (near Conn77) Voltage 10
- (near Conn75) Temperature 2
- TODO:
  Dash excitations, needed or no?
  Dash soft reset
  Maybe combine some EXC signals, not sure
- Labels drawn without touching a wire or pin: BMS.LED.PWR, BRAKE_PRESSED, DASH.GND, DRS_LED, DRS_PWM, IMD.LED.PWR, LATCHING.GND, LATCHING.PWR, LVS_LED, R2D.BUTTON.PWR, R2D.LED.PWR, SPARE.GND, SPARE.PWR, STATUS, TS.ON.BUTTON.PWR, TS.ON.LED.PWR, TSAL.GND, TSAL.PWR, VCU.GND, VCU.PWR, VOLTAGE.GND, VOLTAGE.SIG
- 1
- 2
- 3
- 4
- 5
- 6
- 7
- 8
- 9
- 10
- 11
- A
- B
- C
- D
- E
- F
- G
- H
- Title:
- File: LOOM - LV BOX.kicad_sch
- Sheet: /
- KiCad E.D.A.  kicad (5.1.4)-1
- Size: A2
- Date:
- Rev:
- Id: 1/1

### Library data of the parts
Conn42 Conn44 = Molex_4x2S_Recepticle: P/N: 43025-0800; Value: Molex_4x2S_Recepticle
Conn43 Conn75-Conn86 = Molex_2x1S_Recepticle: P/N: 43645-0200; Value: Molex_2x1S_Recepticle
Conn45-Conn47 = Molex_2x2S_Recepticle: P/N: 43025-0400; Value: Molex_2x2S_Recepticle
Conn48 = Molex_5x2S_Recepticle: P/N: 43025-1000; Value: Molex_5x2S_Recepticle
Conn49 = Molex_3x2S_Recepticle: P/N: 43025-0600; Value: Molex_3x2S_Recepticle
Conn62 = Deutsch_DTM_6S_Pin: Value: Deutsch_DTM_12S_Pin
Conn87 = Molex_4x1S_Recepticle: P/N: 43645-0400; Value: Molex_4x1S_Recepticle
Conn88 = Deutsch_DTM_6P_Pin: Value: TODO: CHECK CONNECTOR
J8-J10 = Conn_01x12: Footprint: Connector_Molex:Molex_Micro-Fit_3.0_43045-1200_2x06_P3.00mm_Horizontal
  J8: Value: TSAL
  J9: Value: POWER
  J10: Value: LATCHING
Conn61 = AMPHENOL-47P-Recepticle: Value: AMPHENOL-47P-Recepticle